# Altium project GMI.430.110 Main Board v.0.0.PrjPcb
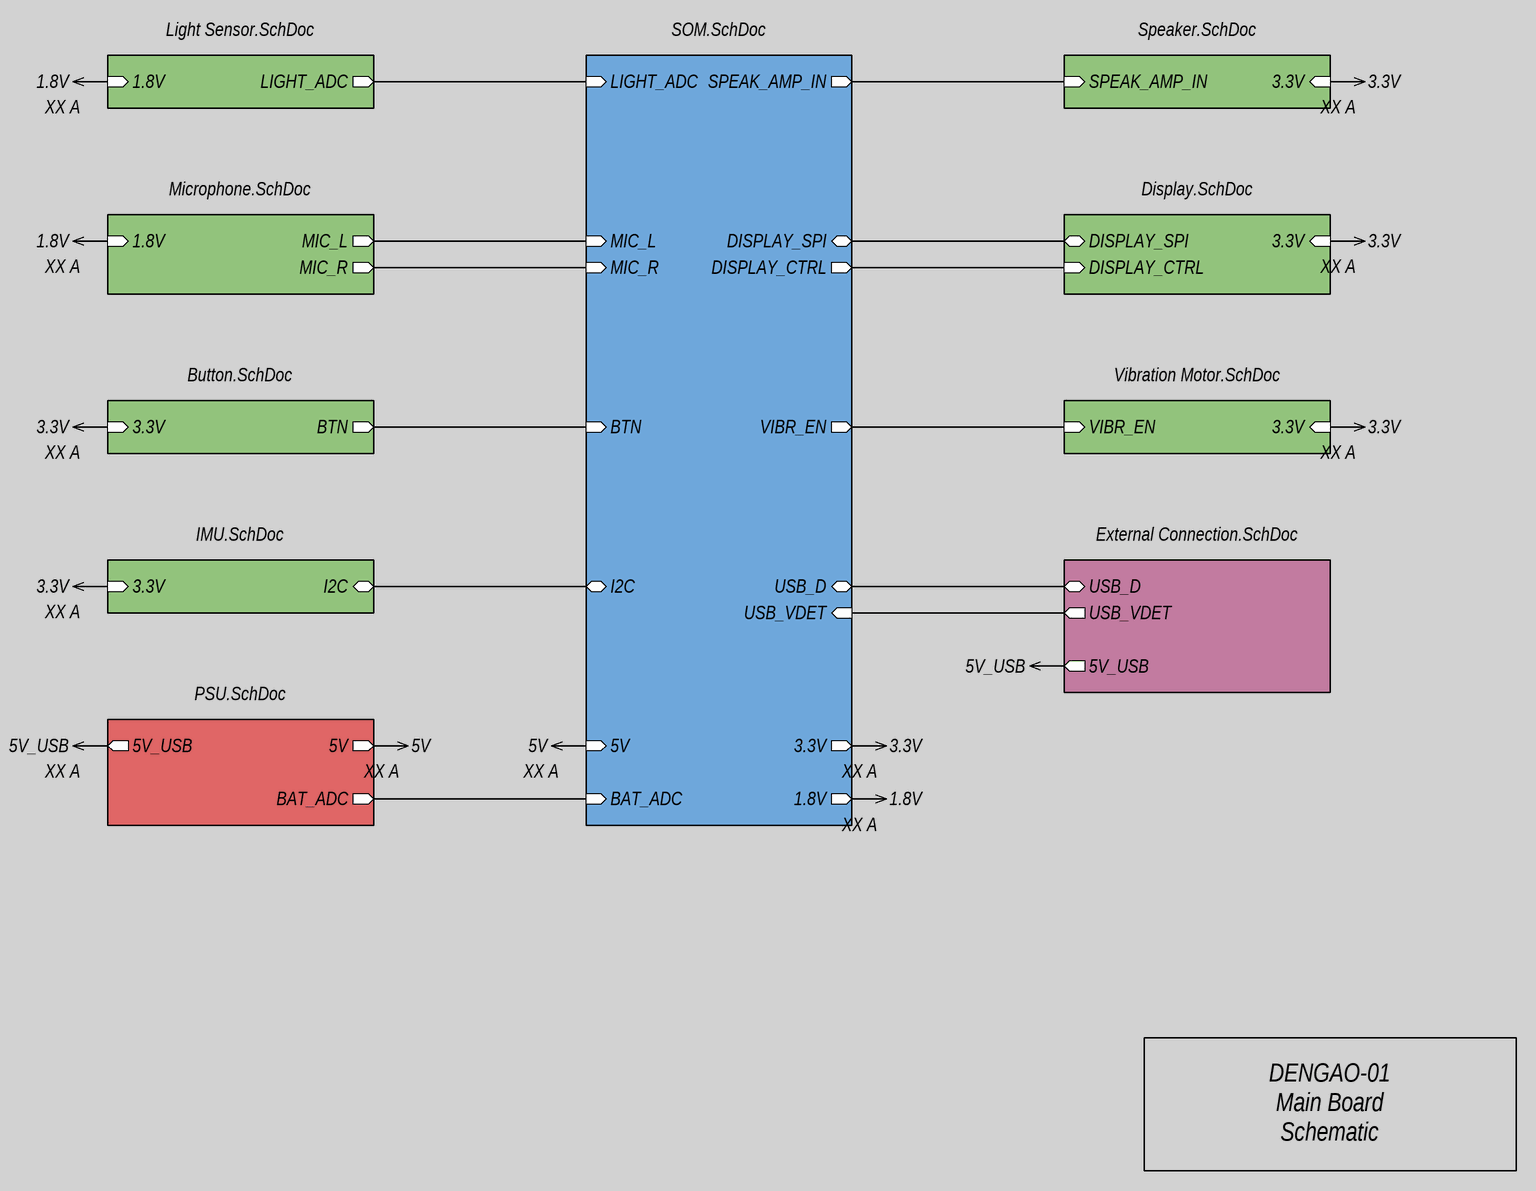
[diagram p0: Main.SchDoc]
DocumentNumberG: GMI.430.110; RevisionG: 0.0
10 sheets, 5 parts. Net scope: hierarchical (ports join the sheet entries above them; power ports are global).
Sheets:
  Main.SchDoc
    Designator = SOM.SchDoc
    Designator = IMU.SchDoc
    Designator = Microphone.SchDoc
    Designator = Display.SchDoc
    Designator = PSU.SchDoc
    Designator = Button.SchDoc
    Designator = Light Sensor.SchDoc
    Designator = External Connection.SchDoc
    Designator = Vibration Motor.SchDoc

## Sheet Main.SchDoc
size 420 x 297 mm; Author: Гавриленко; Address1: Address1; Address2: Address2; Address3: Address3; Address4: Address4; DocumentNumber: GMI.430.110; SheetNumber: 1; SheetTotal: 11; DocumentType: Схема электрическая принципиальная

### Sub-sheets
Designator = SOM.SchDoc: 5V (in), 3.3V (out), 1.8V (out), BAT_ADC (in), I2C (bidir), BTN (in), MIC_R (in), MIC_L (in), LIGHT_ADC (in), SPEAK_AMP_IN (out), DISPLAY_SPI (bidir), DISPLAY_CTRL (out), VIBR_EN (out), USB_D (bidir), USB_VDET (in)
Designator = IMU.SchDoc: I2C (bidir), 3.3V (in)
Designator = Microphone.SchDoc: MIC_L (out), 1.8V (in), MIC_R (out)
Designator = Speaker.SchDoc (file not in this document): SPEAK_AMP_IN (in), 3.3V (in)
Designator = Display.SchDoc: DISPLAY_SPI (bidir), DISPLAY_CTRL (in), 3.3V (in)
Designator = PSU.SchDoc: 5V (out), 5V_USB (out), BAT_ADC (out)
Designator = Button.SchDoc: BTN (out), 3.3V (in)
Designator = Light Sensor.SchDoc: LIGHT_ADC (out), 1.8V (in)
Designator = External Connection.SchDoc: 5V_USB (out), USB_D (bidir), USB_VDET (out)
Designator = Vibration Motor.SchDoc: VIBR_EN (in), 3.3V (in)

### Nets
1.8V: sheet Designator/1.8V, sheet Designator/1.8V, sheet Designator/1.8V
3.3V: sheet Designator/3.3V, sheet Designator/3.3V, sheet Designator/3.3V, sheet Designator/3.3V, sheet Designator/3.3V, sheet Designator/3.3V
5V: sheet Designator/5V, sheet Designator/5V
5V_USB: sheet Designator/5V_USB, sheet Designator/5V_USB
(unnamed): sheet Designator/BAT_ADC, sheet Designator/BAT_ADC
(unnamed): sheet Designator/I2C, sheet Designator/I2C
(unnamed): sheet Designator/BTN, sheet Designator/BTN
(unnamed): sheet Designator/MIC_R, sheet Designator/MIC_R
(unnamed): sheet Designator/MIC_L, sheet Designator/MIC_L
(unnamed): sheet Designator/LIGHT_ADC, sheet Designator/LIGHT_ADC
(unnamed): sheet Designator/SPEAK_AMP_IN, sheet Designator/SPEAK_AMP_IN
(unnamed): sheet Designator/DISPLAY_SPI, sheet Designator/DISPLAY_SPI
(unnamed): sheet Designator/DISPLAY_CTRL, sheet Designator/DISPLAY_CTRL
(unnamed): sheet Designator/VIBR_EN, sheet Designator/VIBR_EN
(unnamed): sheet Designator/USB_D, sheet Designator/USB_D
(unnamed): sheet Designator/USB_VDET, sheet Designator/USB_VDET

### Notes on the sheet
- XX A
- DENGAO-01
  Main Board
  Schematic
- Перв. примен.
- Справ. №
- Подп. и дата
- Инв. № дубл.
- Взам. инв. №
- Разраб.
- Изм.
- Лист
- № докум.
- Подп.
- Дата
- Лит.
- Масса
- Масштаб
- Пров.
- Т.контр.
- Листов
- Инв. № подл.
- Утв.
- Н.контр.
- Копировал
- Формат А3

## Sheet SOM.SchDoc
size 420 x 297 mm; Address1: Address1; Address2: Address2; Address3: Address3; Address4: Address4; DocumentNumber: GMI.430.110; SheetNumber: 9; SheetTotal: 10; DocumentType: Схема электрическая принципиальная
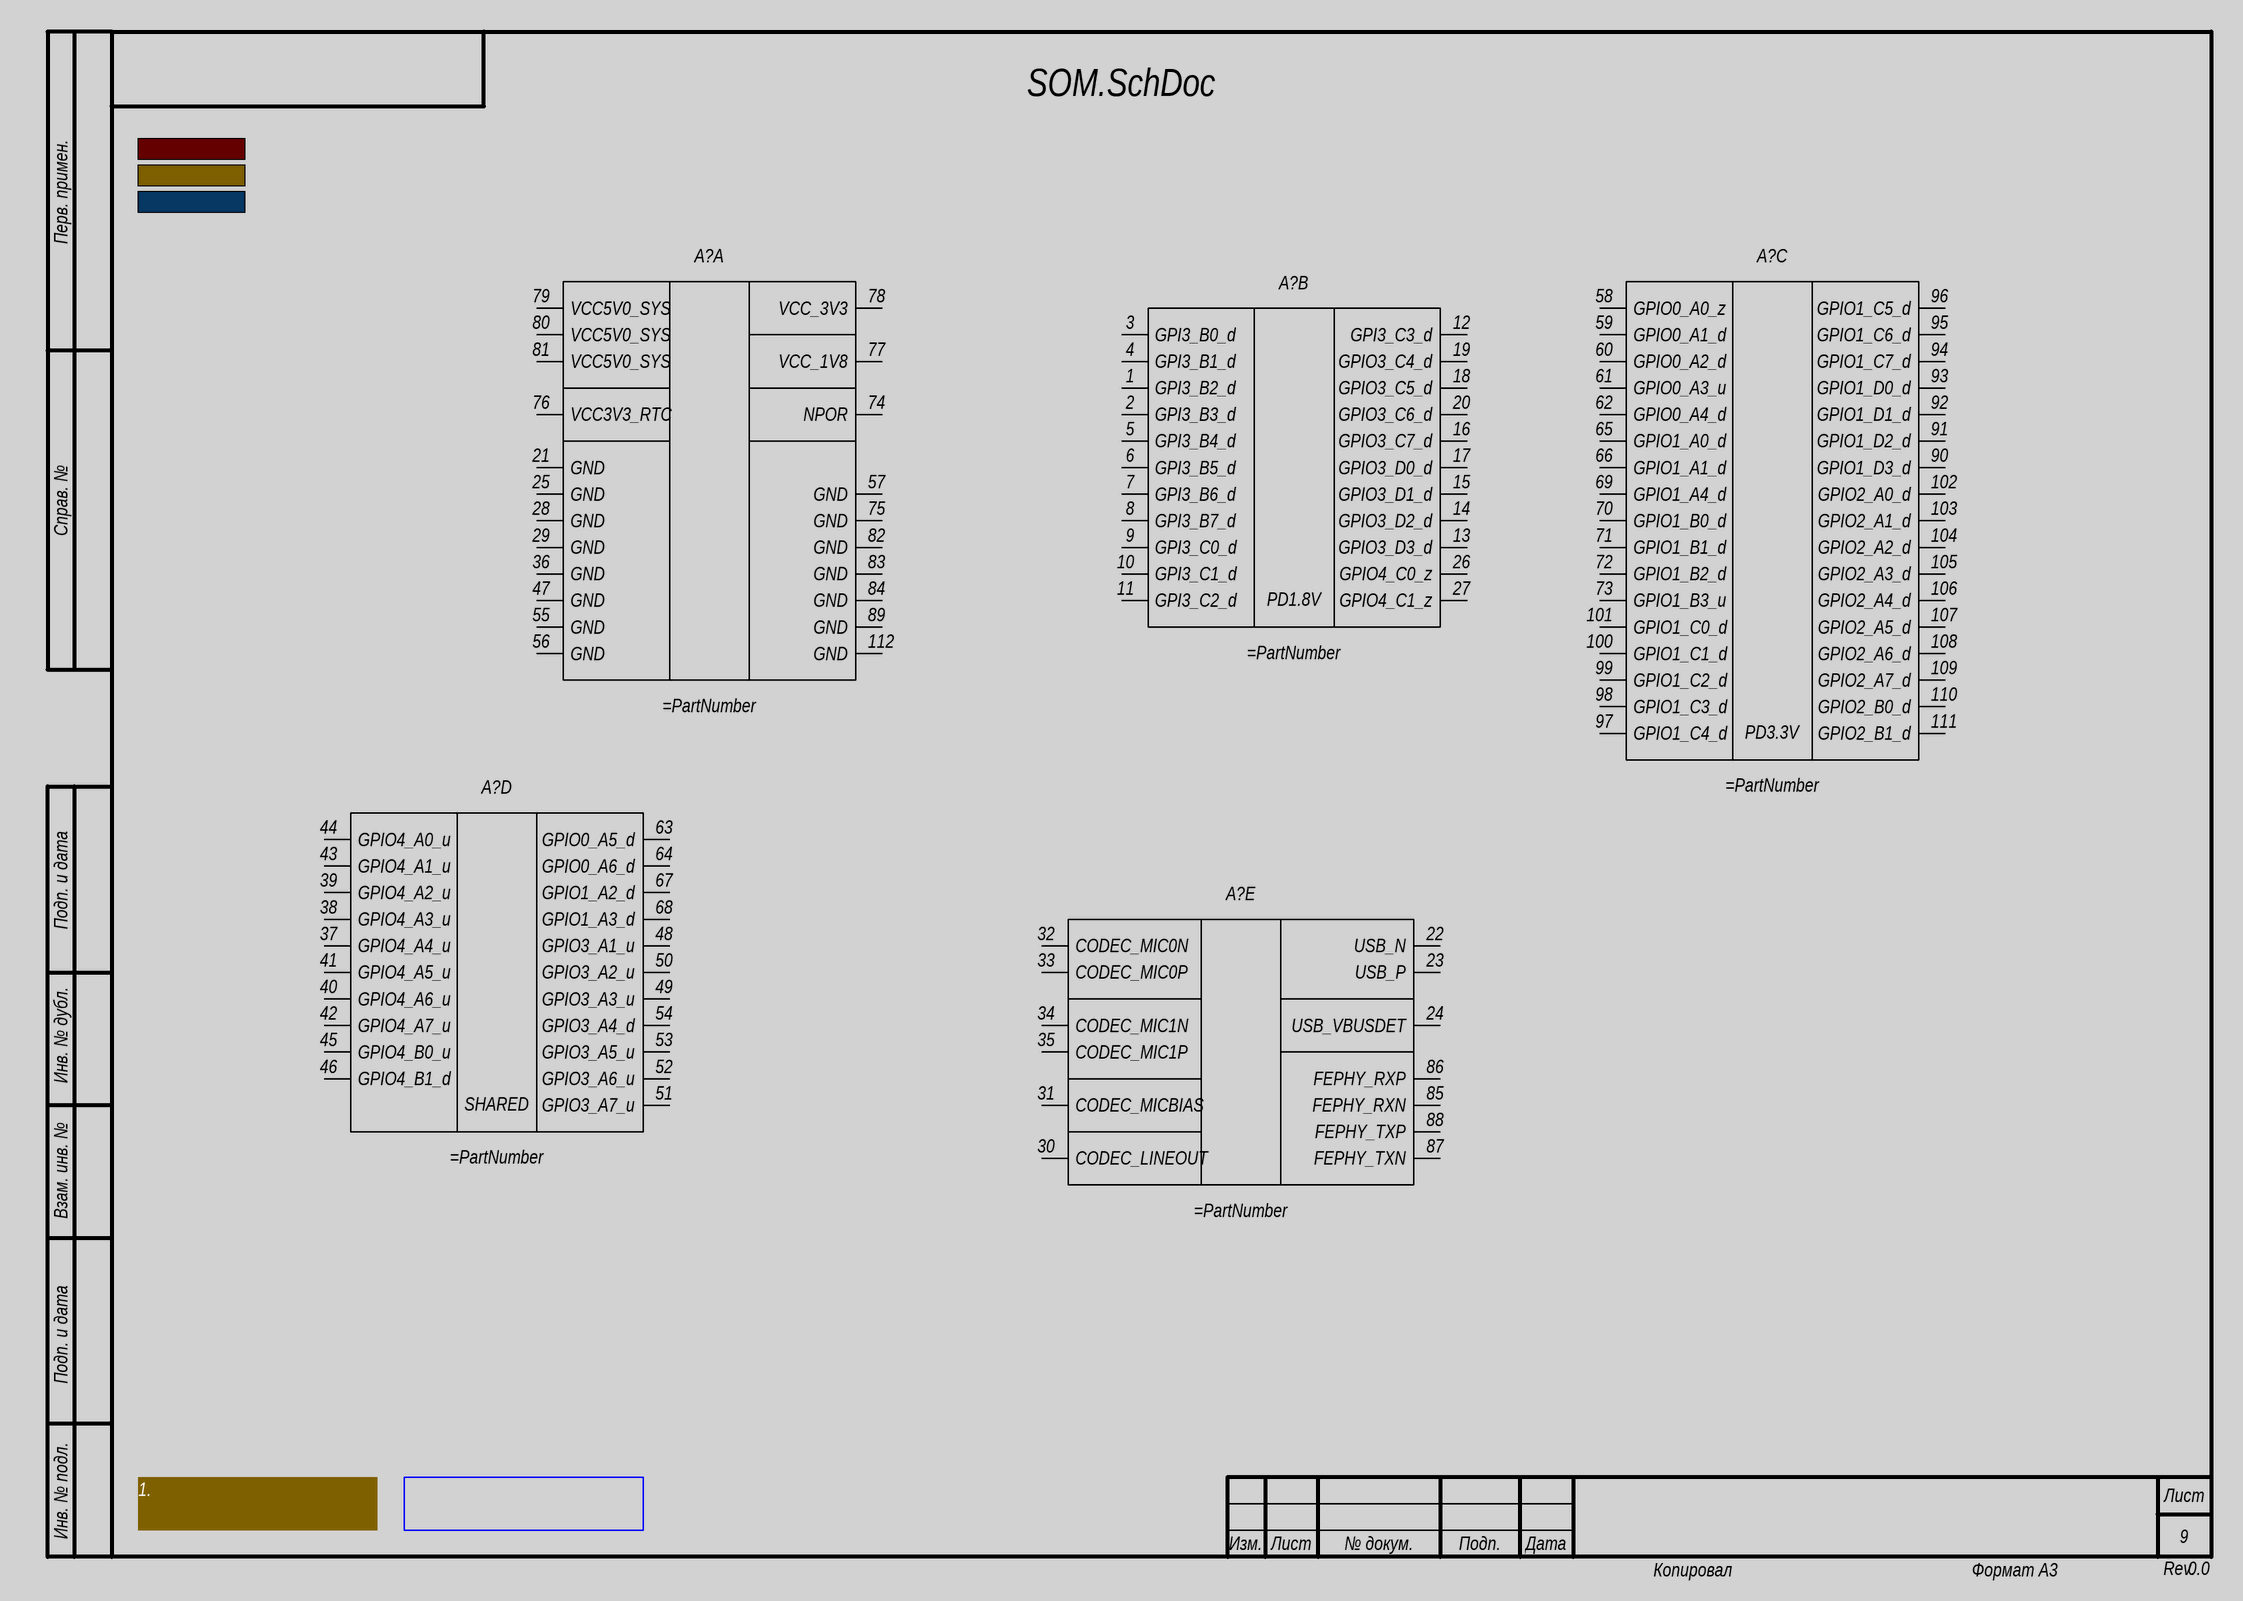
[diagram p1: SOM.SchDoc]

### Parts
(Parts that share a designator on the sheet are numbered #1, #2 ... from top to bottom, then left to right.)
A?#1  I  (value not drawn)  (part A of 5)
A?#2  I  (value not drawn)  (part C of 5)
A?#3  I  (value not drawn)  (part B of 5)
A?#4  I  (value not drawn)  (part D of 5)
A?#5  I  (value not drawn)  (part E of 5)

### Ports
 (in)

### Nets

Not connected (* = marked no-connect by the designer): A?#1 21(GND) 25(GND) 28(GND) 29(GND) 36(GND) 47(GND) 55(GND) 56(GND) 57(GND) 74(NPOR) 75(GND) 76(VCC3V3_RTC) 77(VCC_1V8) 78(VCC_3V3) 79(VCC5V0_SYS) 80(VCC5V0_SYS) 81(VCC5V0_SYS) 82(GND) 83(GND) 84(GND) 89(GND) 112(GND); A?#2 58(GPIO0_A0_z) 59(GPIO0_A1_d) 60(GPIO0_A2_d) 61(GPIO0_A3_u) 62(GPIO0_A4_d) 65(GPIO1_A0_d) 66(GPIO1_A1_d) 69(GPIO1_A4_d) 70(GPIO1_B0_d) 71(GPIO1_B1_d) 72(GPIO1_B2_d) 73(GPIO1_B3_u) 90(GPIO1_D3_d) 91(GPIO1_D2_d) 92(GPIO1_D1_d) 93(GPIO1_D0_d) 94(GPIO1_C7_d) 95(GPIO1_C6_d) 96(GPIO1_C5_d) 97(GPIO1_C4_d) 98(GPIO1_C3_d) 99(GPIO1_C2_d) 100(GPIO1_C1_d) 101(GPIO1_C0_d) 102(GPIO2_A0_d) 103(GPIO2_A1_d) 104(GPIO2_A2_d) 105(GPIO2_A3_d) 106(GPIO2_A4_d) 107(GPIO2_A5_d) 108(GPIO2_A6_d) 109(GPIO2_A7_d) 110(GPIO2_B0_d) 111(GPIO2_B1_d); A?#3 1(GPI3_B2_d) 2(GPI3_B3_d) 3(GPI3_B0_d) 4(GPI3_B1_d) 5(GPI3_B4_d) 6(GPI3_B5_d) 7(GPI3_B6_d) 8(GPI3_B7_d) 9(GPI3_C0_d) 10(GPI3_C1_d) 11(GPI3_C2_d) 12(GPI3_C3_d) 13(GPIO3_D3_d) 14(GPIO3_D2_d) 15(GPIO3_D1_d) 16(GPIO3_C7_d) 17(GPIO3_D0_d) 18(GPIO3_C5_d) 19(GPIO3_C4_d) 20(GPIO3_C6_d) 26(GPIO4_C0_z) 27(GPIO4_C1_z); A?#4 37(GPIO4_A4_u) 38(GPIO4_A3_u) 39(GPIO4_A2_u) 40(GPIO4_A6_u) 41(GPIO4_A5_u) 42(GPIO4_A7_u) 43(GPIO4_A1_u) 44(GPIO4_A0_u) 45(GPIO4_B0_u) 46(GPIO4_B1_d) 48(GPIO3_A1_u) 49(GPIO3_A3_u) 50(GPIO3_A2_u) 51(GPIO3_A7_u) 52(GPIO3_A6_u) 53(GPIO3_A5_u) 54(GPIO3_A4_d) 63(GPIO0_A5_d) 64(GPIO0_A6_d) 67(GPIO1_A2_d) 68(GPIO1_A3_d); A?#5 22(USB_N) 23(USB_P) 24(USB_VBUSDET) 30(CODEC_LINEOUT) 31(CODEC_MICBIAS) 32(CODEC_MIC0N) 33(CODEC_MIC0P) 34(CODEC_MIC1N) 35(CODEC_MIC1P) 85(FEPHY_RXN) 86(FEPHY_RXP) 87(FEPHY_TXN) 88(FEPHY_TXP)

### Notes on the sheet
- 1.
- Rev.
- Перв. примен.
- Справ. №
- Подп. и дата
- Инв. № дубл.
- Взам. инв. №
- Инв. № подл.
- Изм.
- Лист
- № докум.
- Подп.
- Дата
- Копировал
- Формат А3
- (in symbol Core1106, part B) PD1.8V
- (in symbol Core1106, part C) PD3.3V
- (in symbol Core1106, part D) SHARED

### Library data of the parts
A?#1-A?#5 = Core1106: RV1106 Development Board; Manufacturer: Shenzhen Luckfox Tecnology Co., Ltd.; TemperatureRange: -10...+80°C; ClassName: General; ComponentType: Модуль; Install: I

## Sheet IMU.SchDoc
size 420 x 297 mm; Address1: Address1; Address2: Address2; Address3: Address3; Address4: Address4; DocumentNumber: GMI.430.110; SheetNumber: 7; SheetTotal: 10; DocumentType: Схема электрическая принципиальная
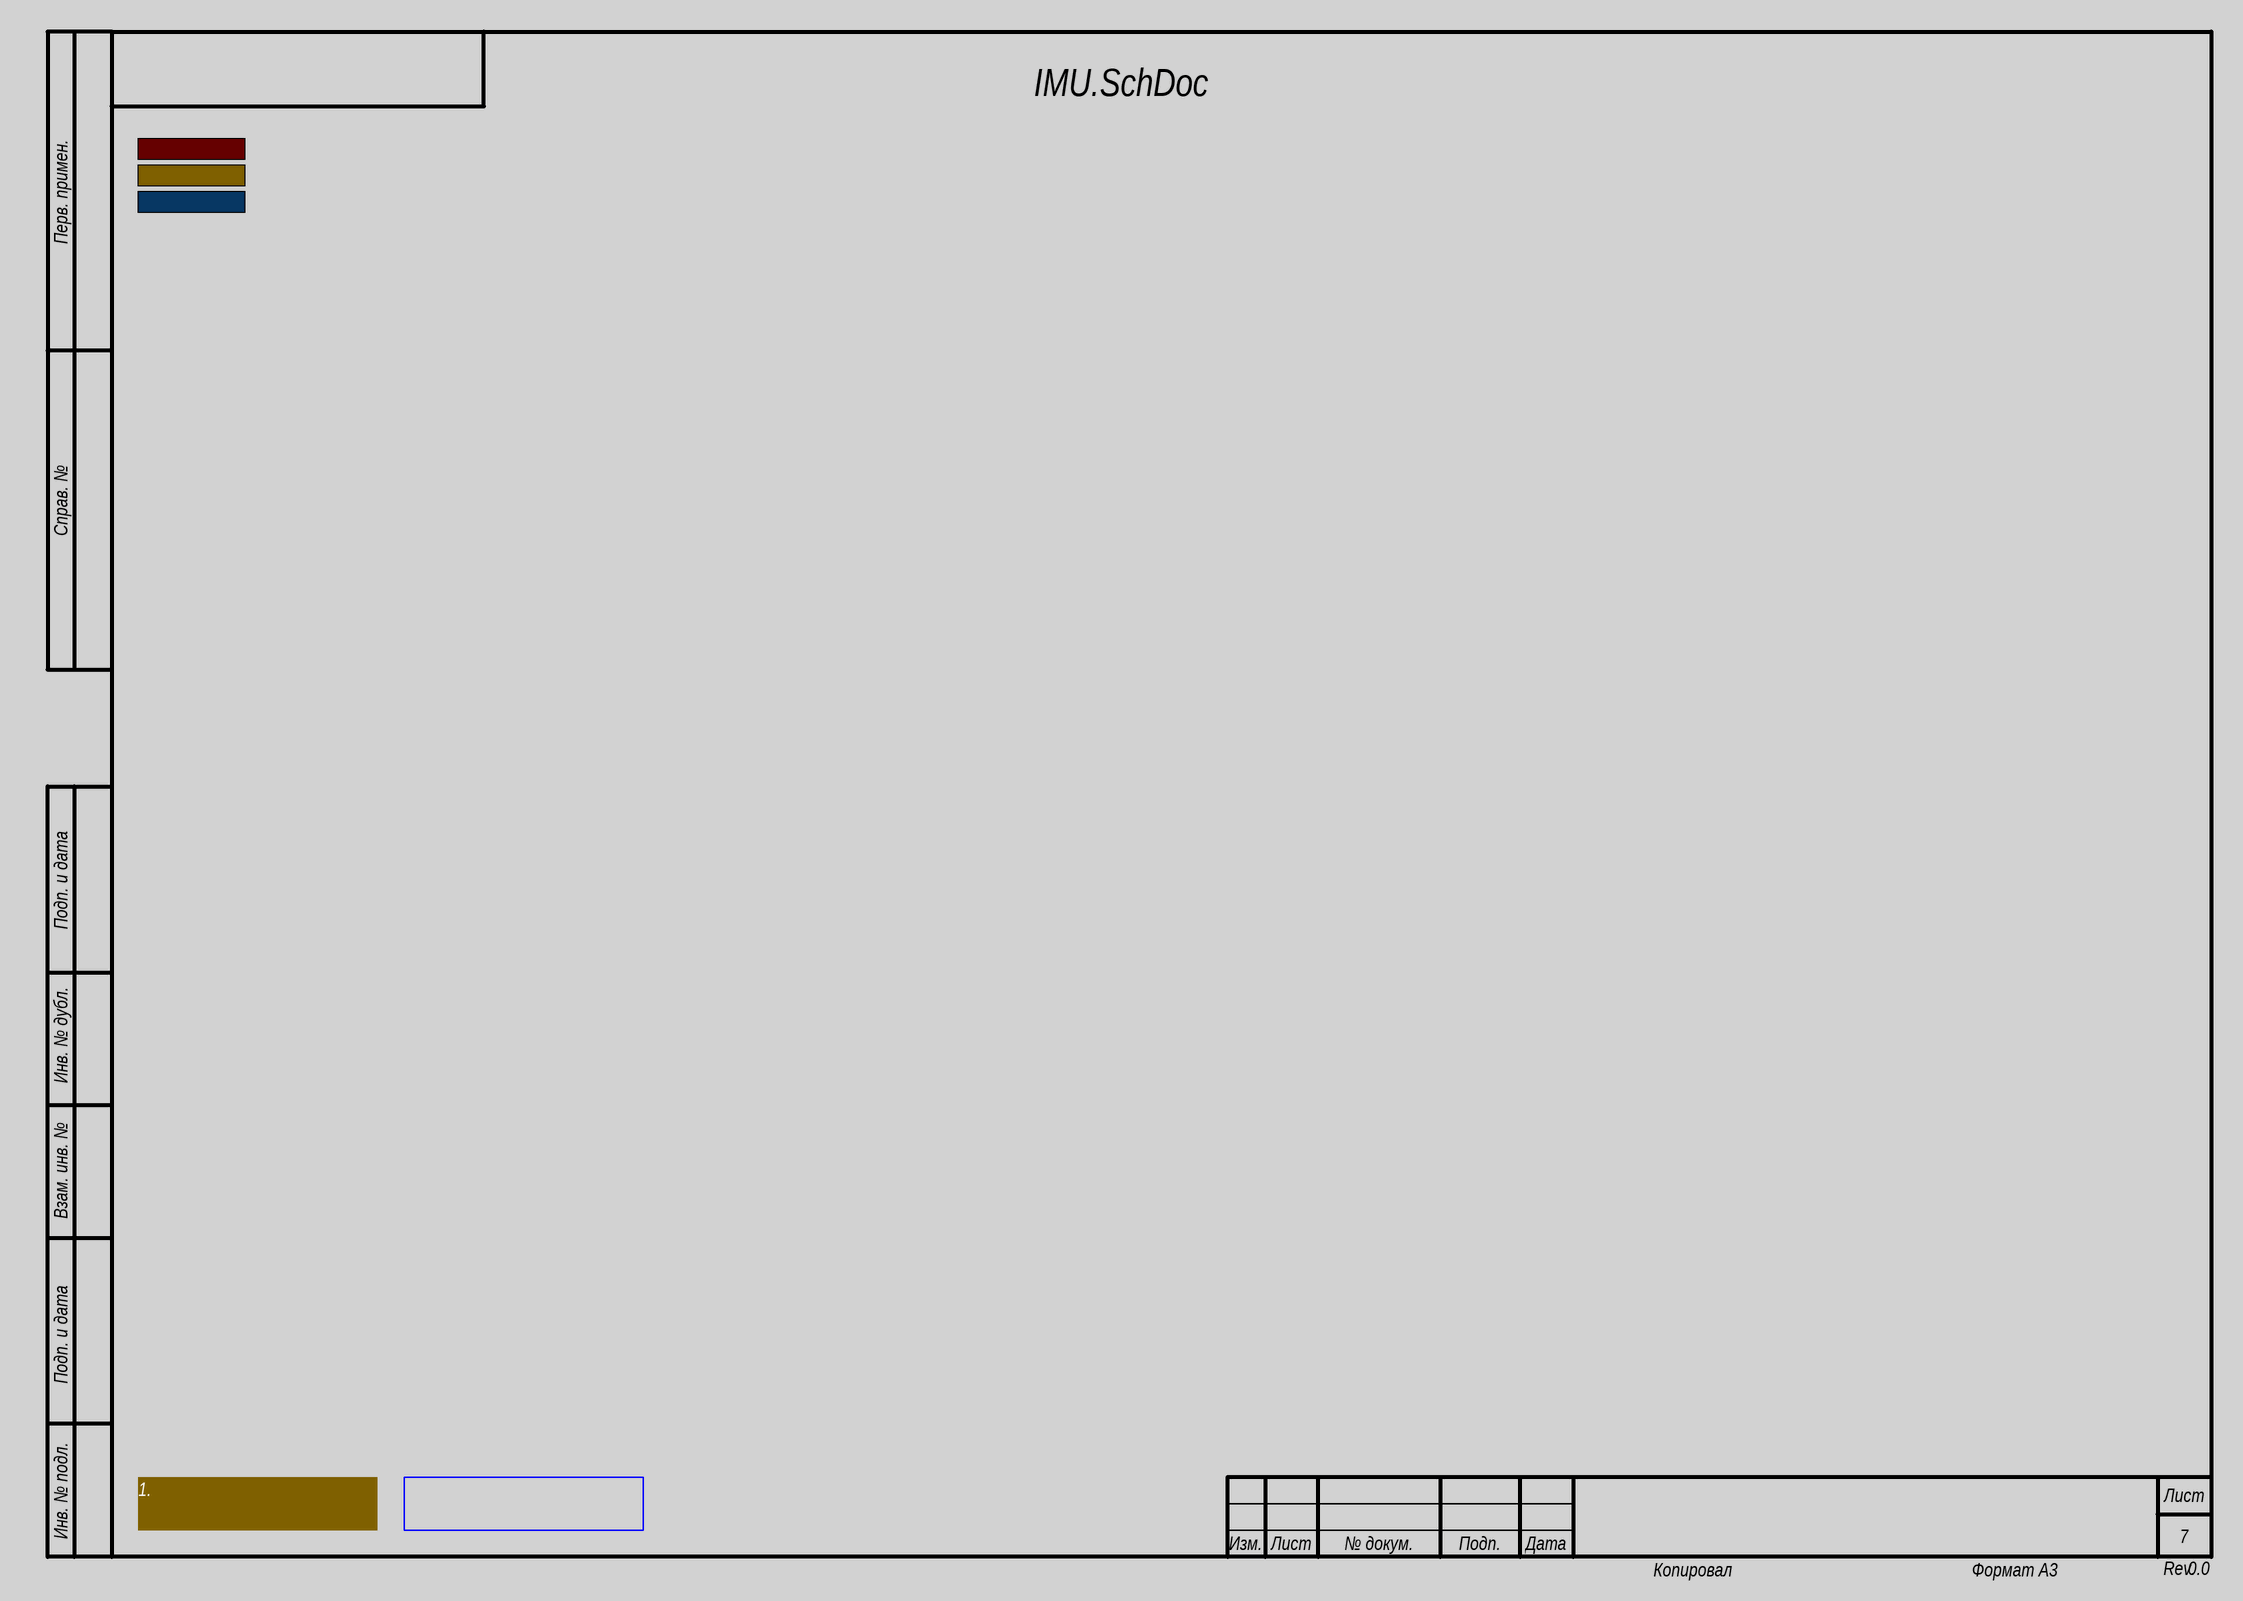
[diagram p2: IMU.SchDoc]

### Ports
 (in)

### Notes on the sheet
- 1.
- Rev.
- Перв. примен.
- Справ. №
- Подп. и дата
- Инв. № дубл.
- Взам. инв. №
- Инв. № подл.
- Изм.
- Лист
- № докум.
- Подп.
- Дата
- Копировал
- Формат А3

## Sheet Microphone.SchDoc
size 420 x 297 mm; Address1: Address1; Address2: Address2; Address3: Address3; Address4: Address4; DocumentNumber: GMI.430.110; SheetNumber: 8; SheetTotal: 10; DocumentType: Схема электрическая принципиальная
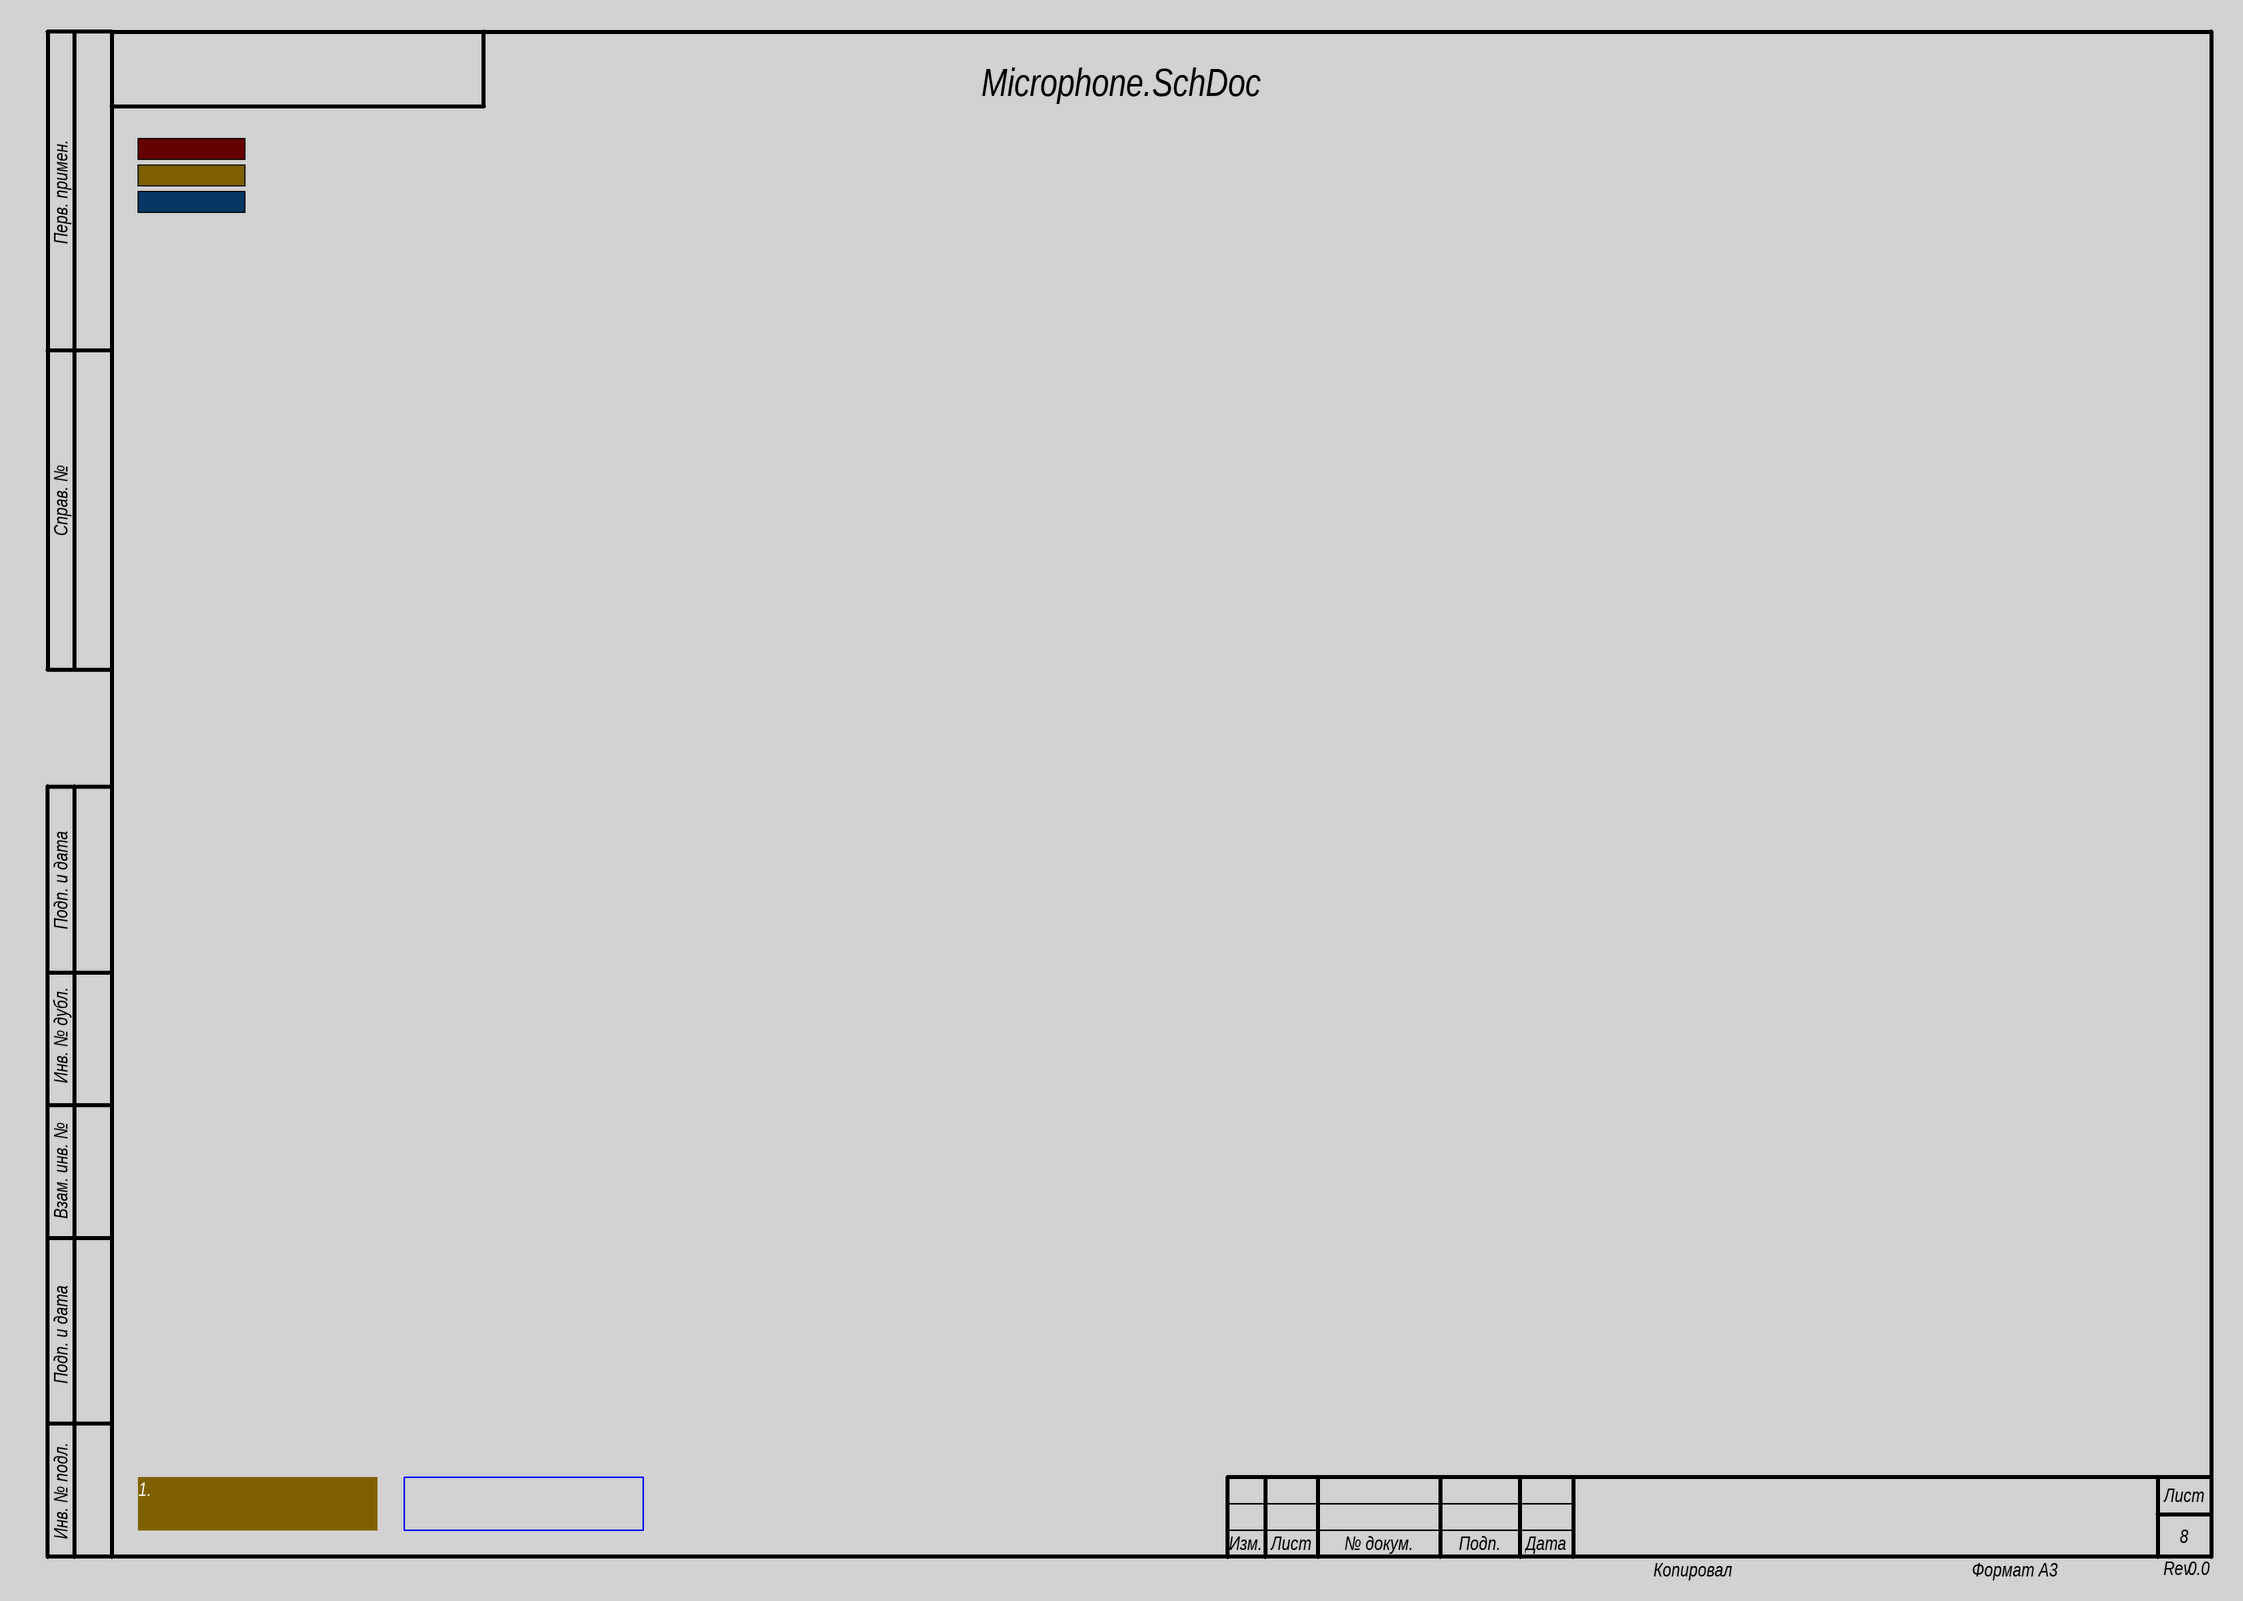
[diagram p3: Microphone.SchDoc]

### Ports
 (in)

### Notes on the sheet
- 1.
- Rev.
- Перв. примен.
- Справ. №
- Подп. и дата
- Инв. № дубл.
- Взам. инв. №
- Инв. № подл.
- Изм.
- Лист
- № докум.
- Подп.
- Дата
- Копировал
- Формат А3

## Sheet Display.SchDoc
size 420 x 297 mm; Address1: Address1; Address2: Address2; Address3: Address3; Address4: Address4; DocumentNumber: GMI.430.110; SheetNumber: 5; SheetTotal: 10; DocumentType: Схема электрическая принципиальная
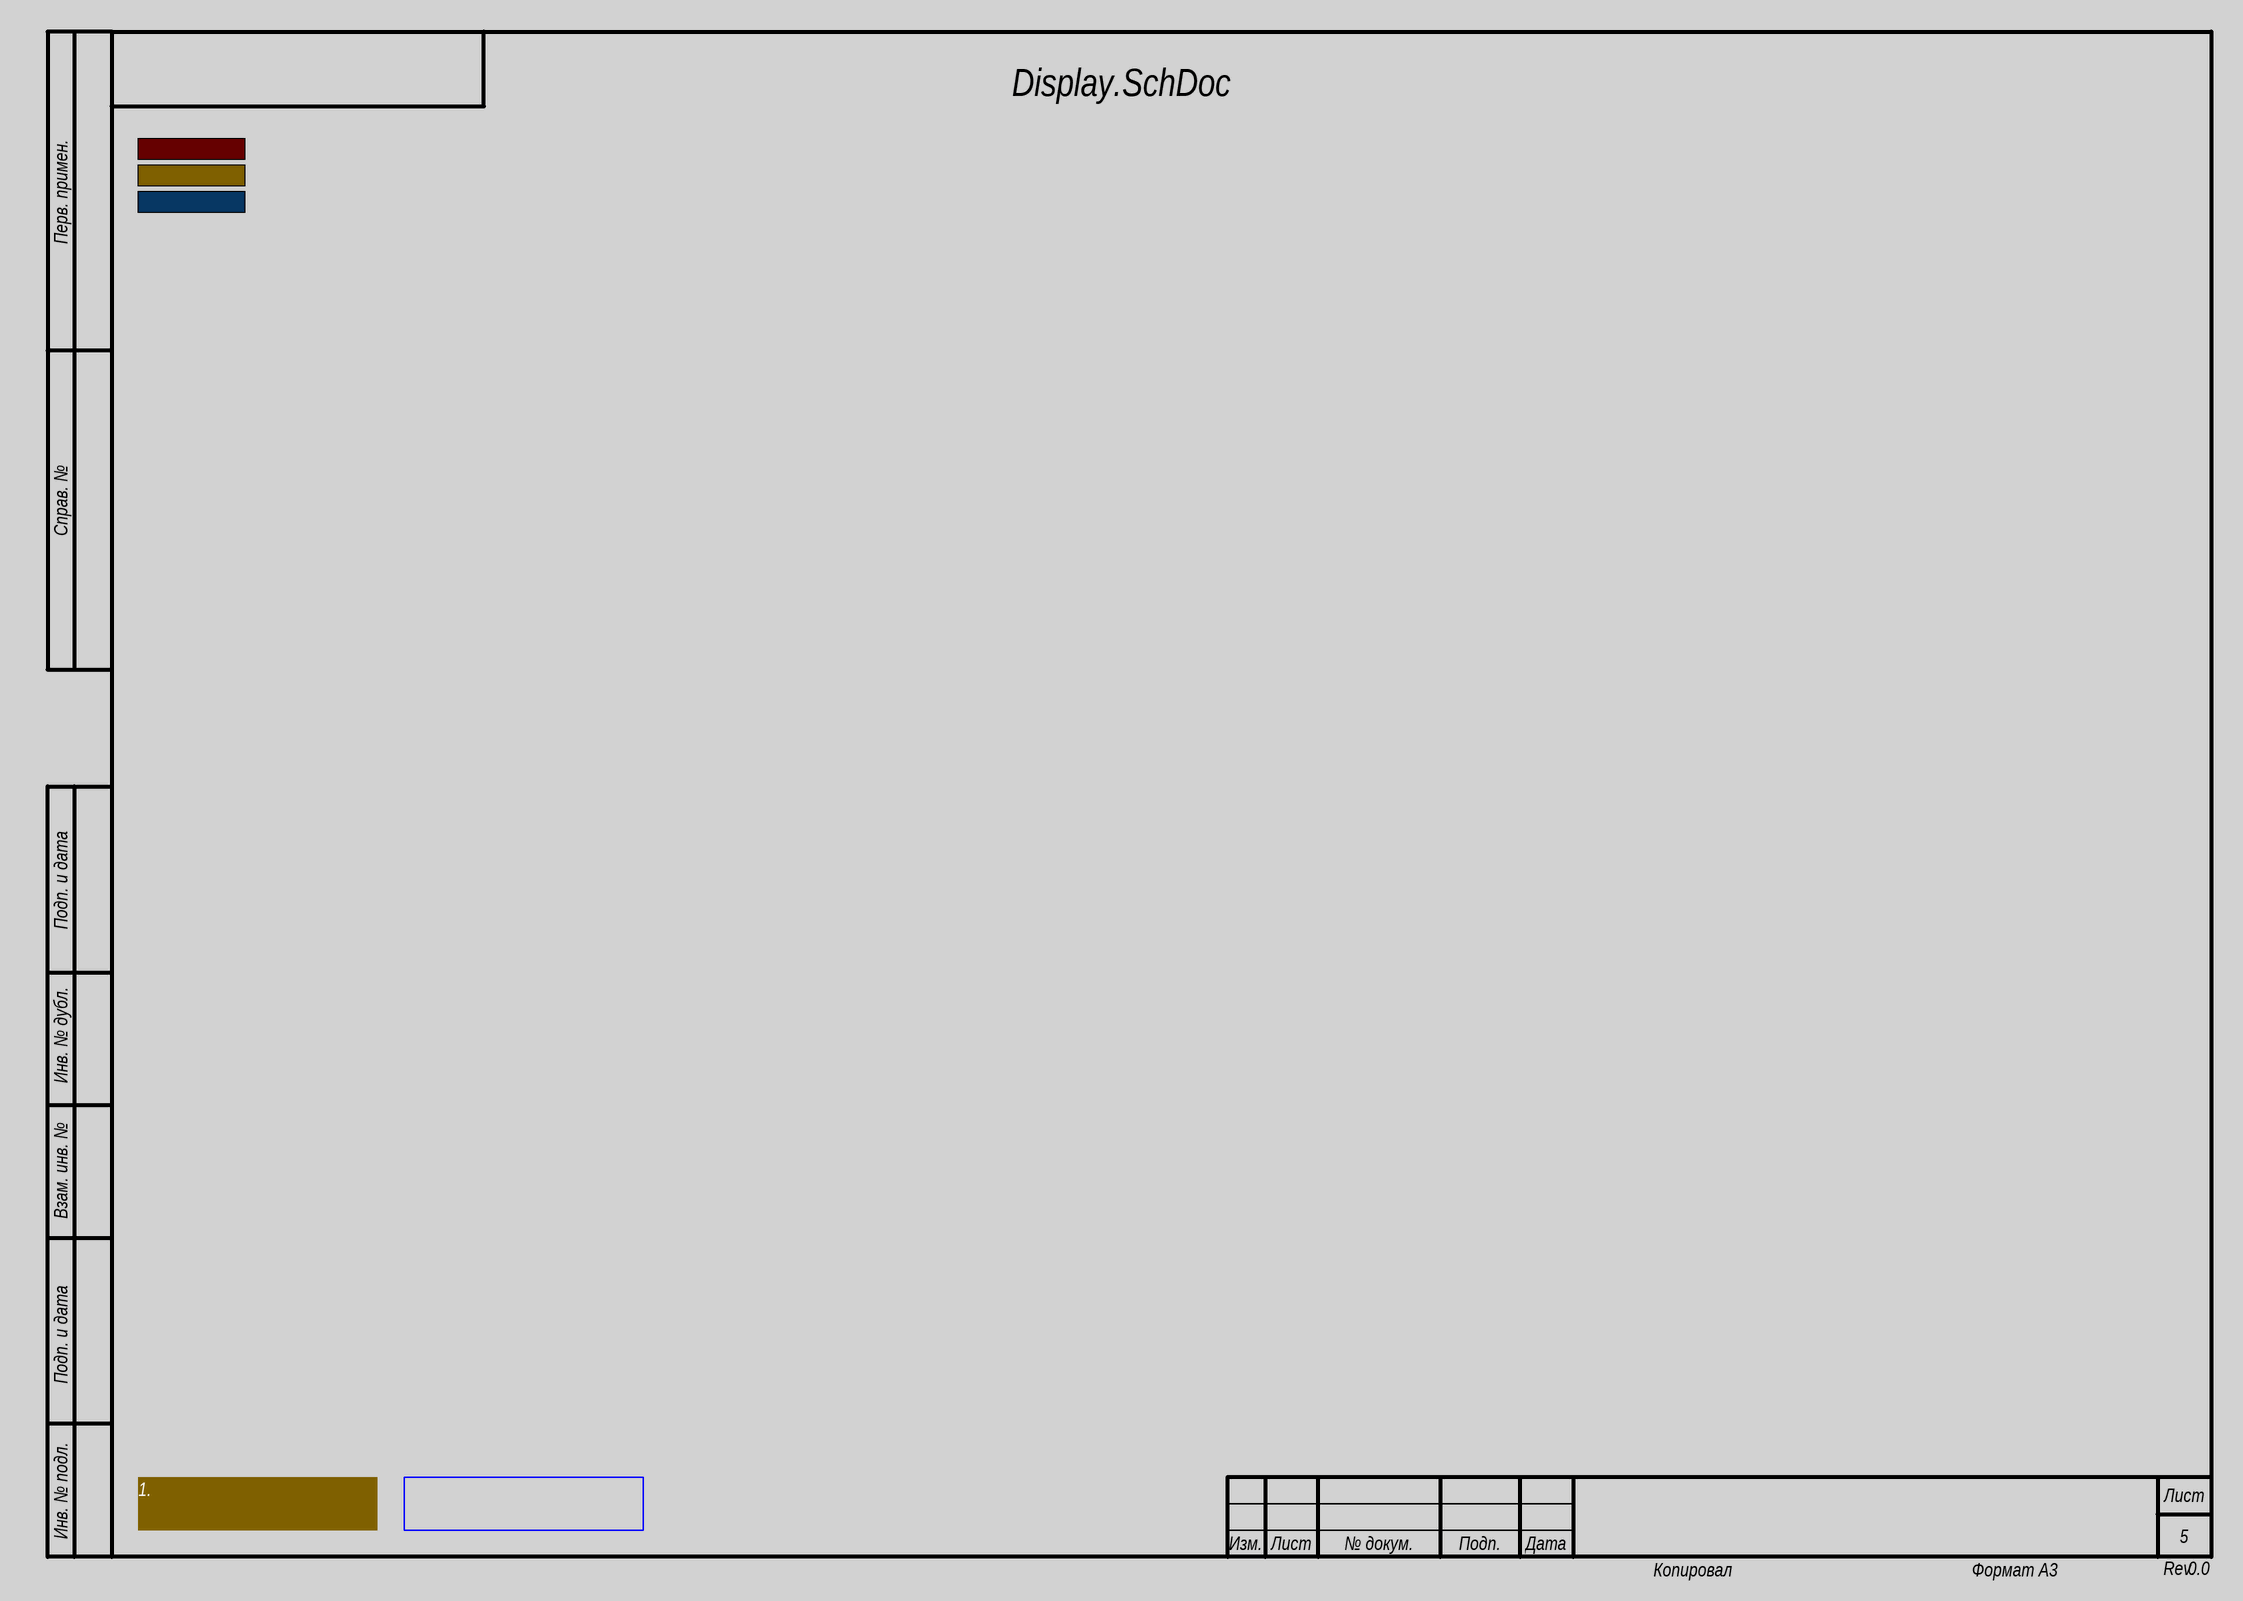
[diagram p4: Display.SchDoc]

### Ports
 (in)

### Notes on the sheet
- 1.
- Rev.
- Перв. примен.
- Справ. №
- Подп. и дата
- Инв. № дубл.
- Взам. инв. №
- Инв. № подл.
- Изм.
- Лист
- № докум.
- Подп.
- Дата
- Копировал
- Формат А3

## Sheet PSU.SchDoc
size 420 x 297 mm; Address1: Address1; Address2: Address2; Address3: Address3; Address4: Address4; DocumentNumber: GMI.430.110; SheetNumber: 2; SheetTotal: 2; DocumentType: Схема электрическая принципиальная
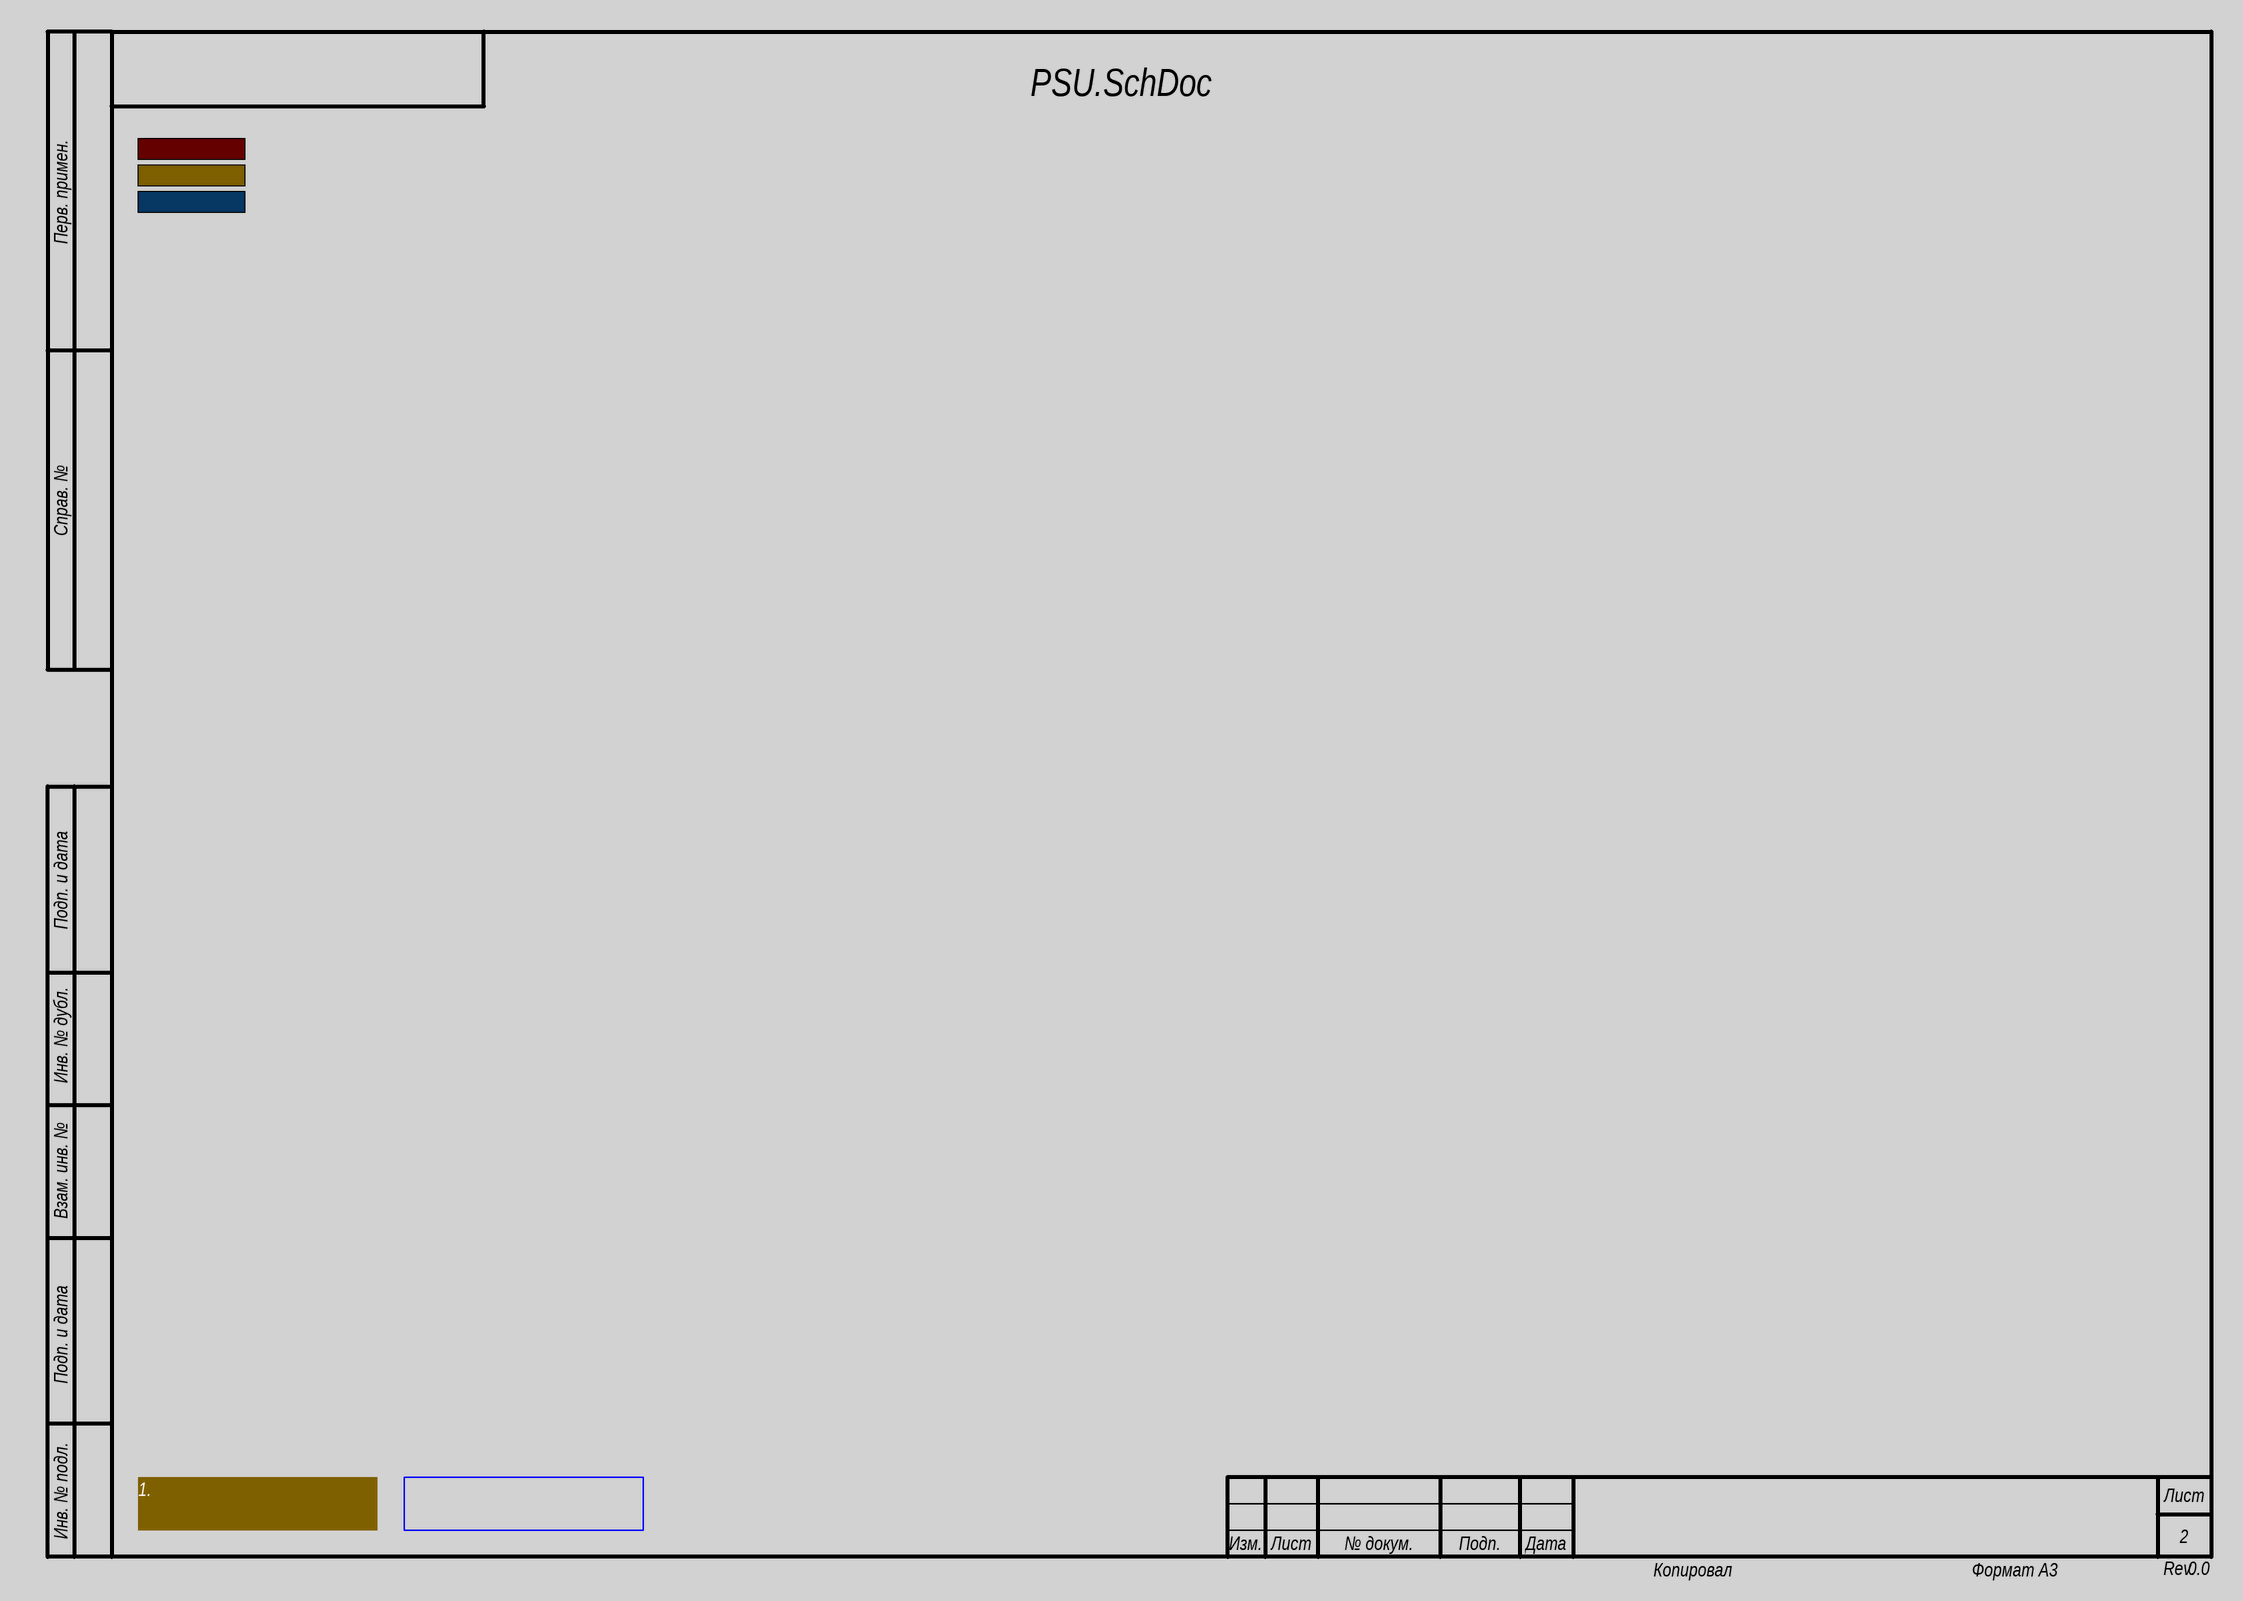
[diagram p5: PSU.SchDoc]

### Ports
 (in, see Main[1B], Current Sensing Main[1C], PSU Backup[1B], PSU Main[1B], Switch Backup[1A]),  (in, see Main[2B], Current Sensing Main[4A]),  (in, see Main[2B], Current Sensing Main[4A], PSU Backup[4B], PSU Control[4A], PSU Main[4B], Switch Backup[1A], Switch Main[1A])

### Notes on the sheet
- 1.
- Rev.
- Перв. примен.
- Справ. №
- Подп. и дата
- Инв. № дубл.
- Взам. инв. №
- Инв. № подл.
- Изм.
- Лист
- № докум.
- Подп.
- Дата
- Копировал
- Формат А3

## Sheet Button.SchDoc
size 420 x 297 mm; Address1: Address1; Address2: Address2; Address3: Address3; Address4: Address4; DocumentNumber: GMI.430.110; SheetNumber: 1; SheetTotal: 11; DocumentType: Схема электрическая принципиальная
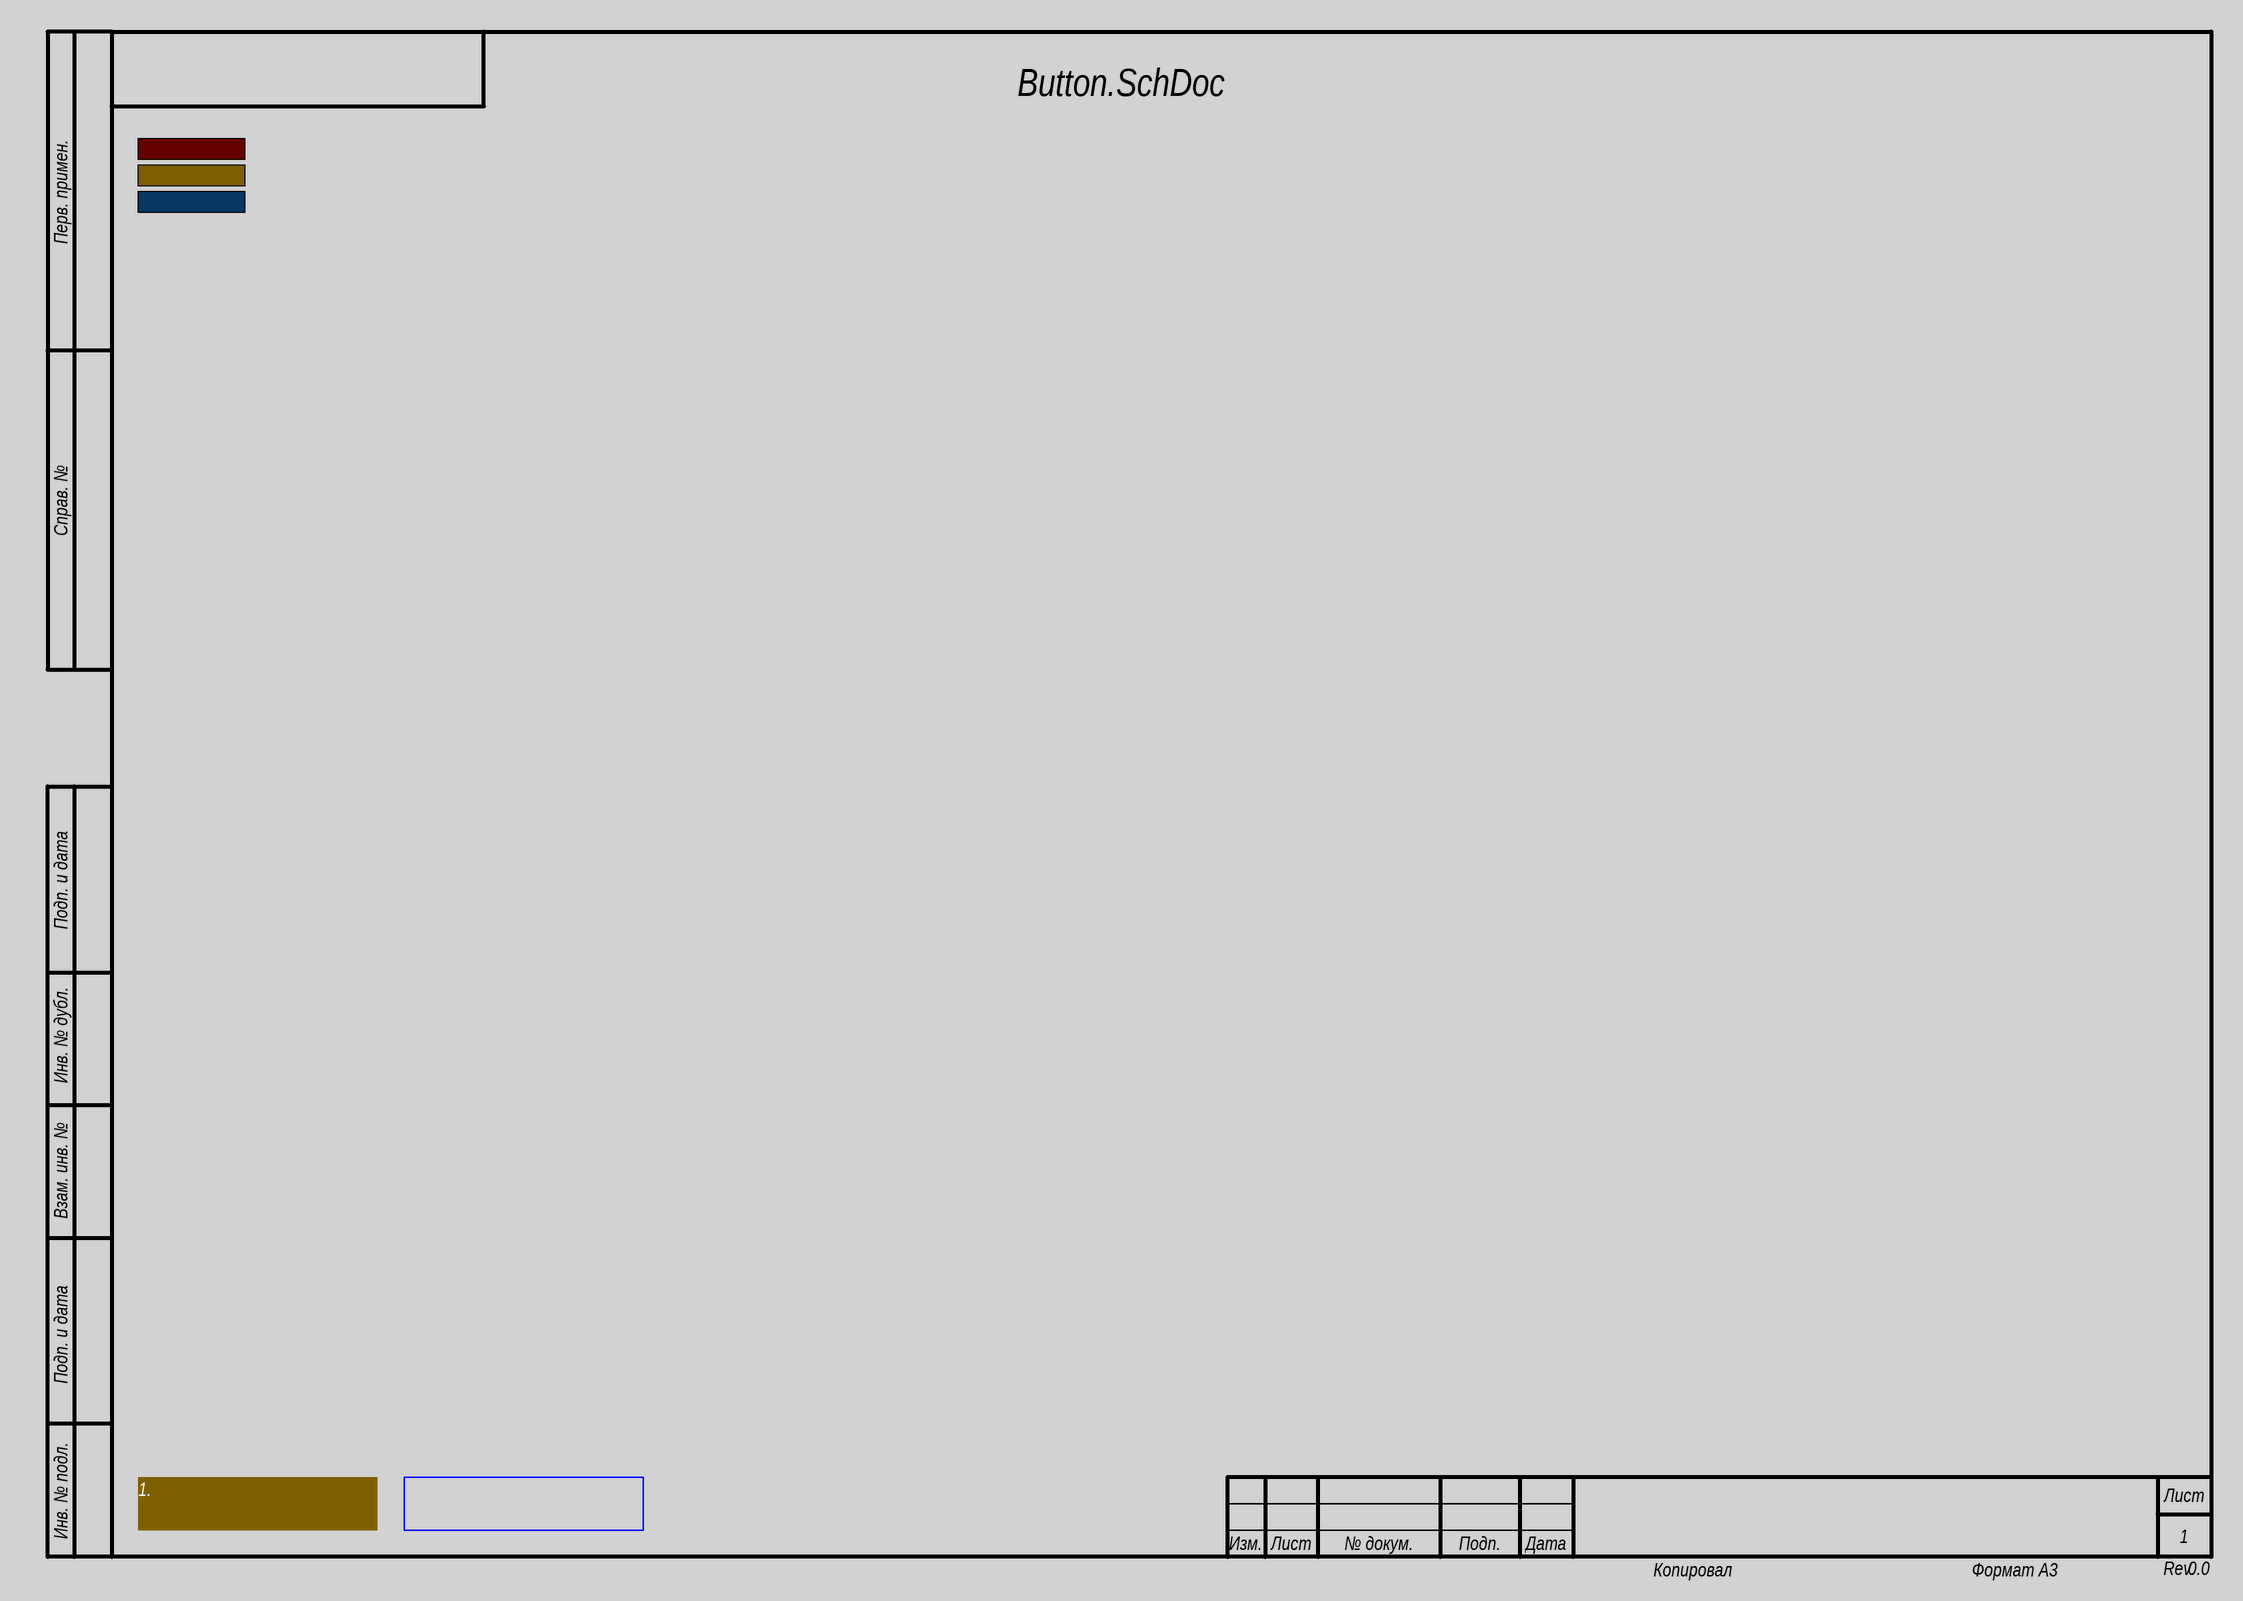
[diagram p6: Button.SchDoc]

### Ports
 (in)

### Notes on the sheet
- 1.
- Rev.
- Перв. примен.
- Справ. №
- Подп. и дата
- Инв. № дубл.
- Взам. инв. №
- Инв. № подл.
- Изм.
- Лист
- № докум.
- Подп.
- Дата
- Копировал
- Формат А3

## Sheet Light Sensor.SchDoc
size 420 x 297 mm; Address1: Address1; Address2: Address2; Address3: Address3; Address4: Address4; DocumentNumber: GMI.430.110; SheetNumber: 6; SheetTotal: 10; DocumentType: Схема электрическая принципиальная
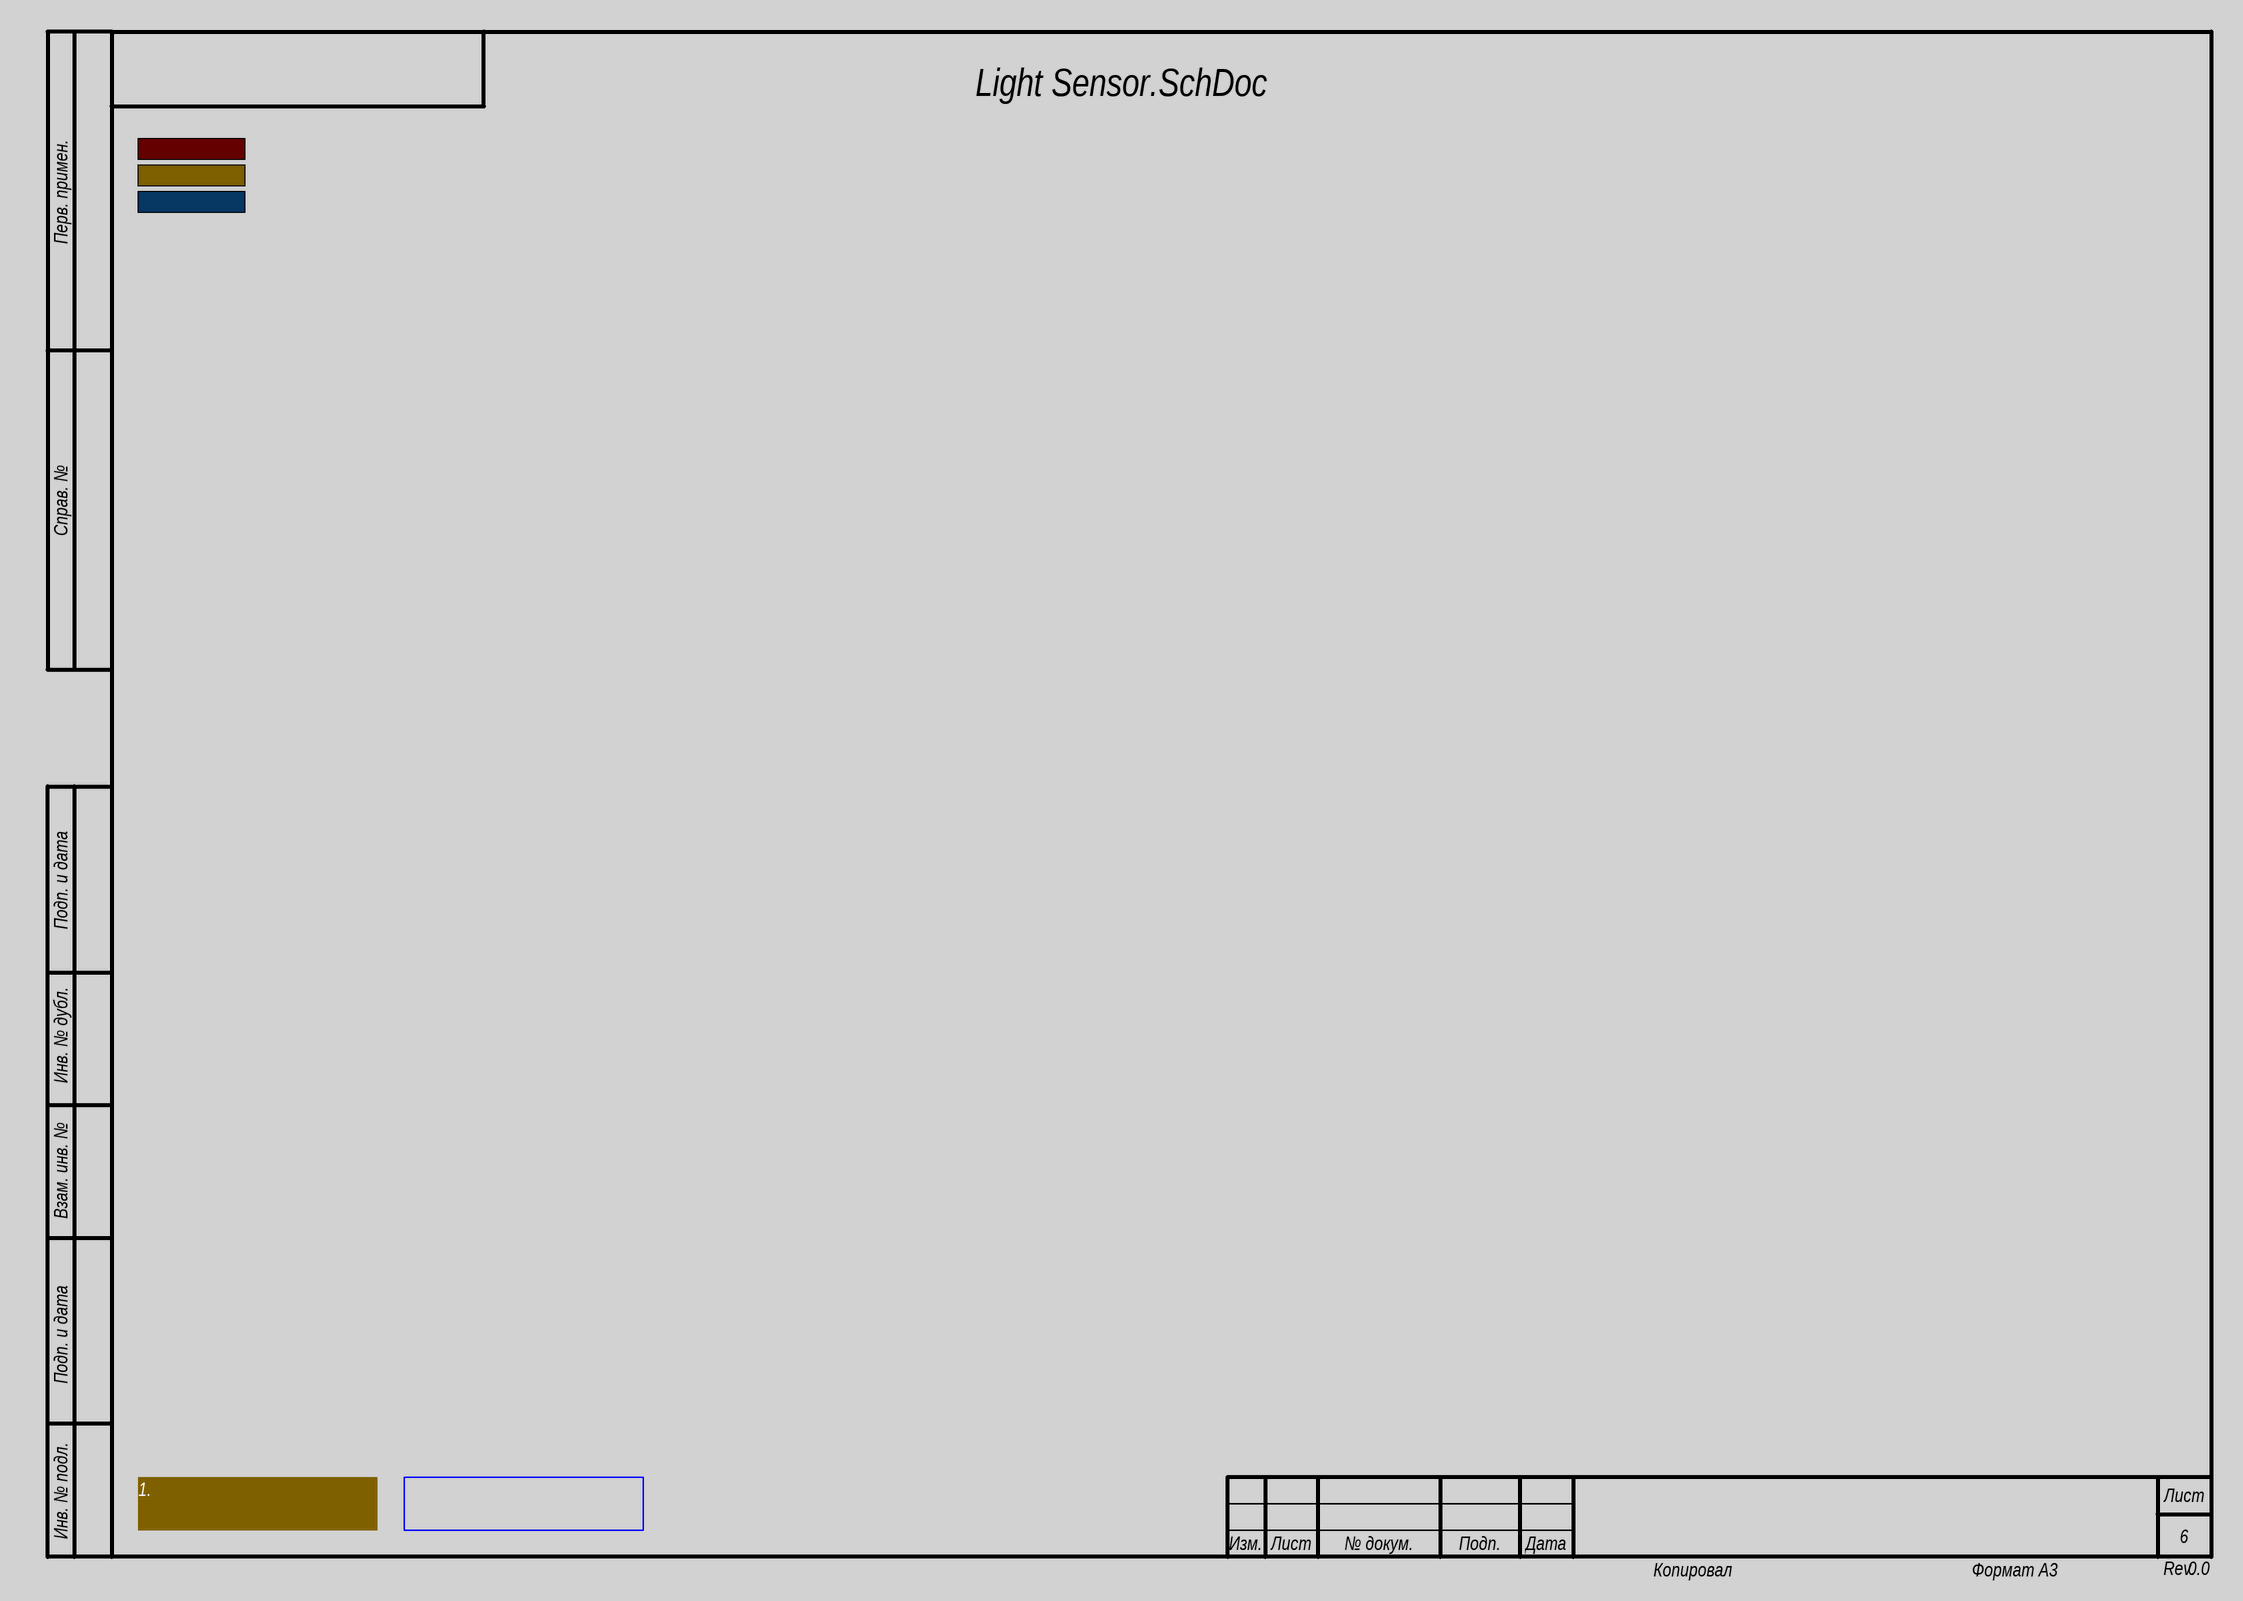
[diagram p7: Light Sensor.SchDoc]

### Ports
 (in)

### Notes on the sheet
- 1.
- Rev.
- Перв. примен.
- Справ. №
- Подп. и дата
- Инв. № дубл.
- Взам. инв. №
- Инв. № подл.
- Изм.
- Лист
- № докум.
- Подп.
- Дата
- Копировал
- Формат А3

## Sheet External Connection.SchDoc
size 420 x 297 mm; Address1: Address1; Address2: Address2; Address3: Address3; Address4: Address4; DocumentNumber: GMI.430.110; SheetNumber: 4; SheetTotal: 10; DocumentType: Схема электрическая принципиальная
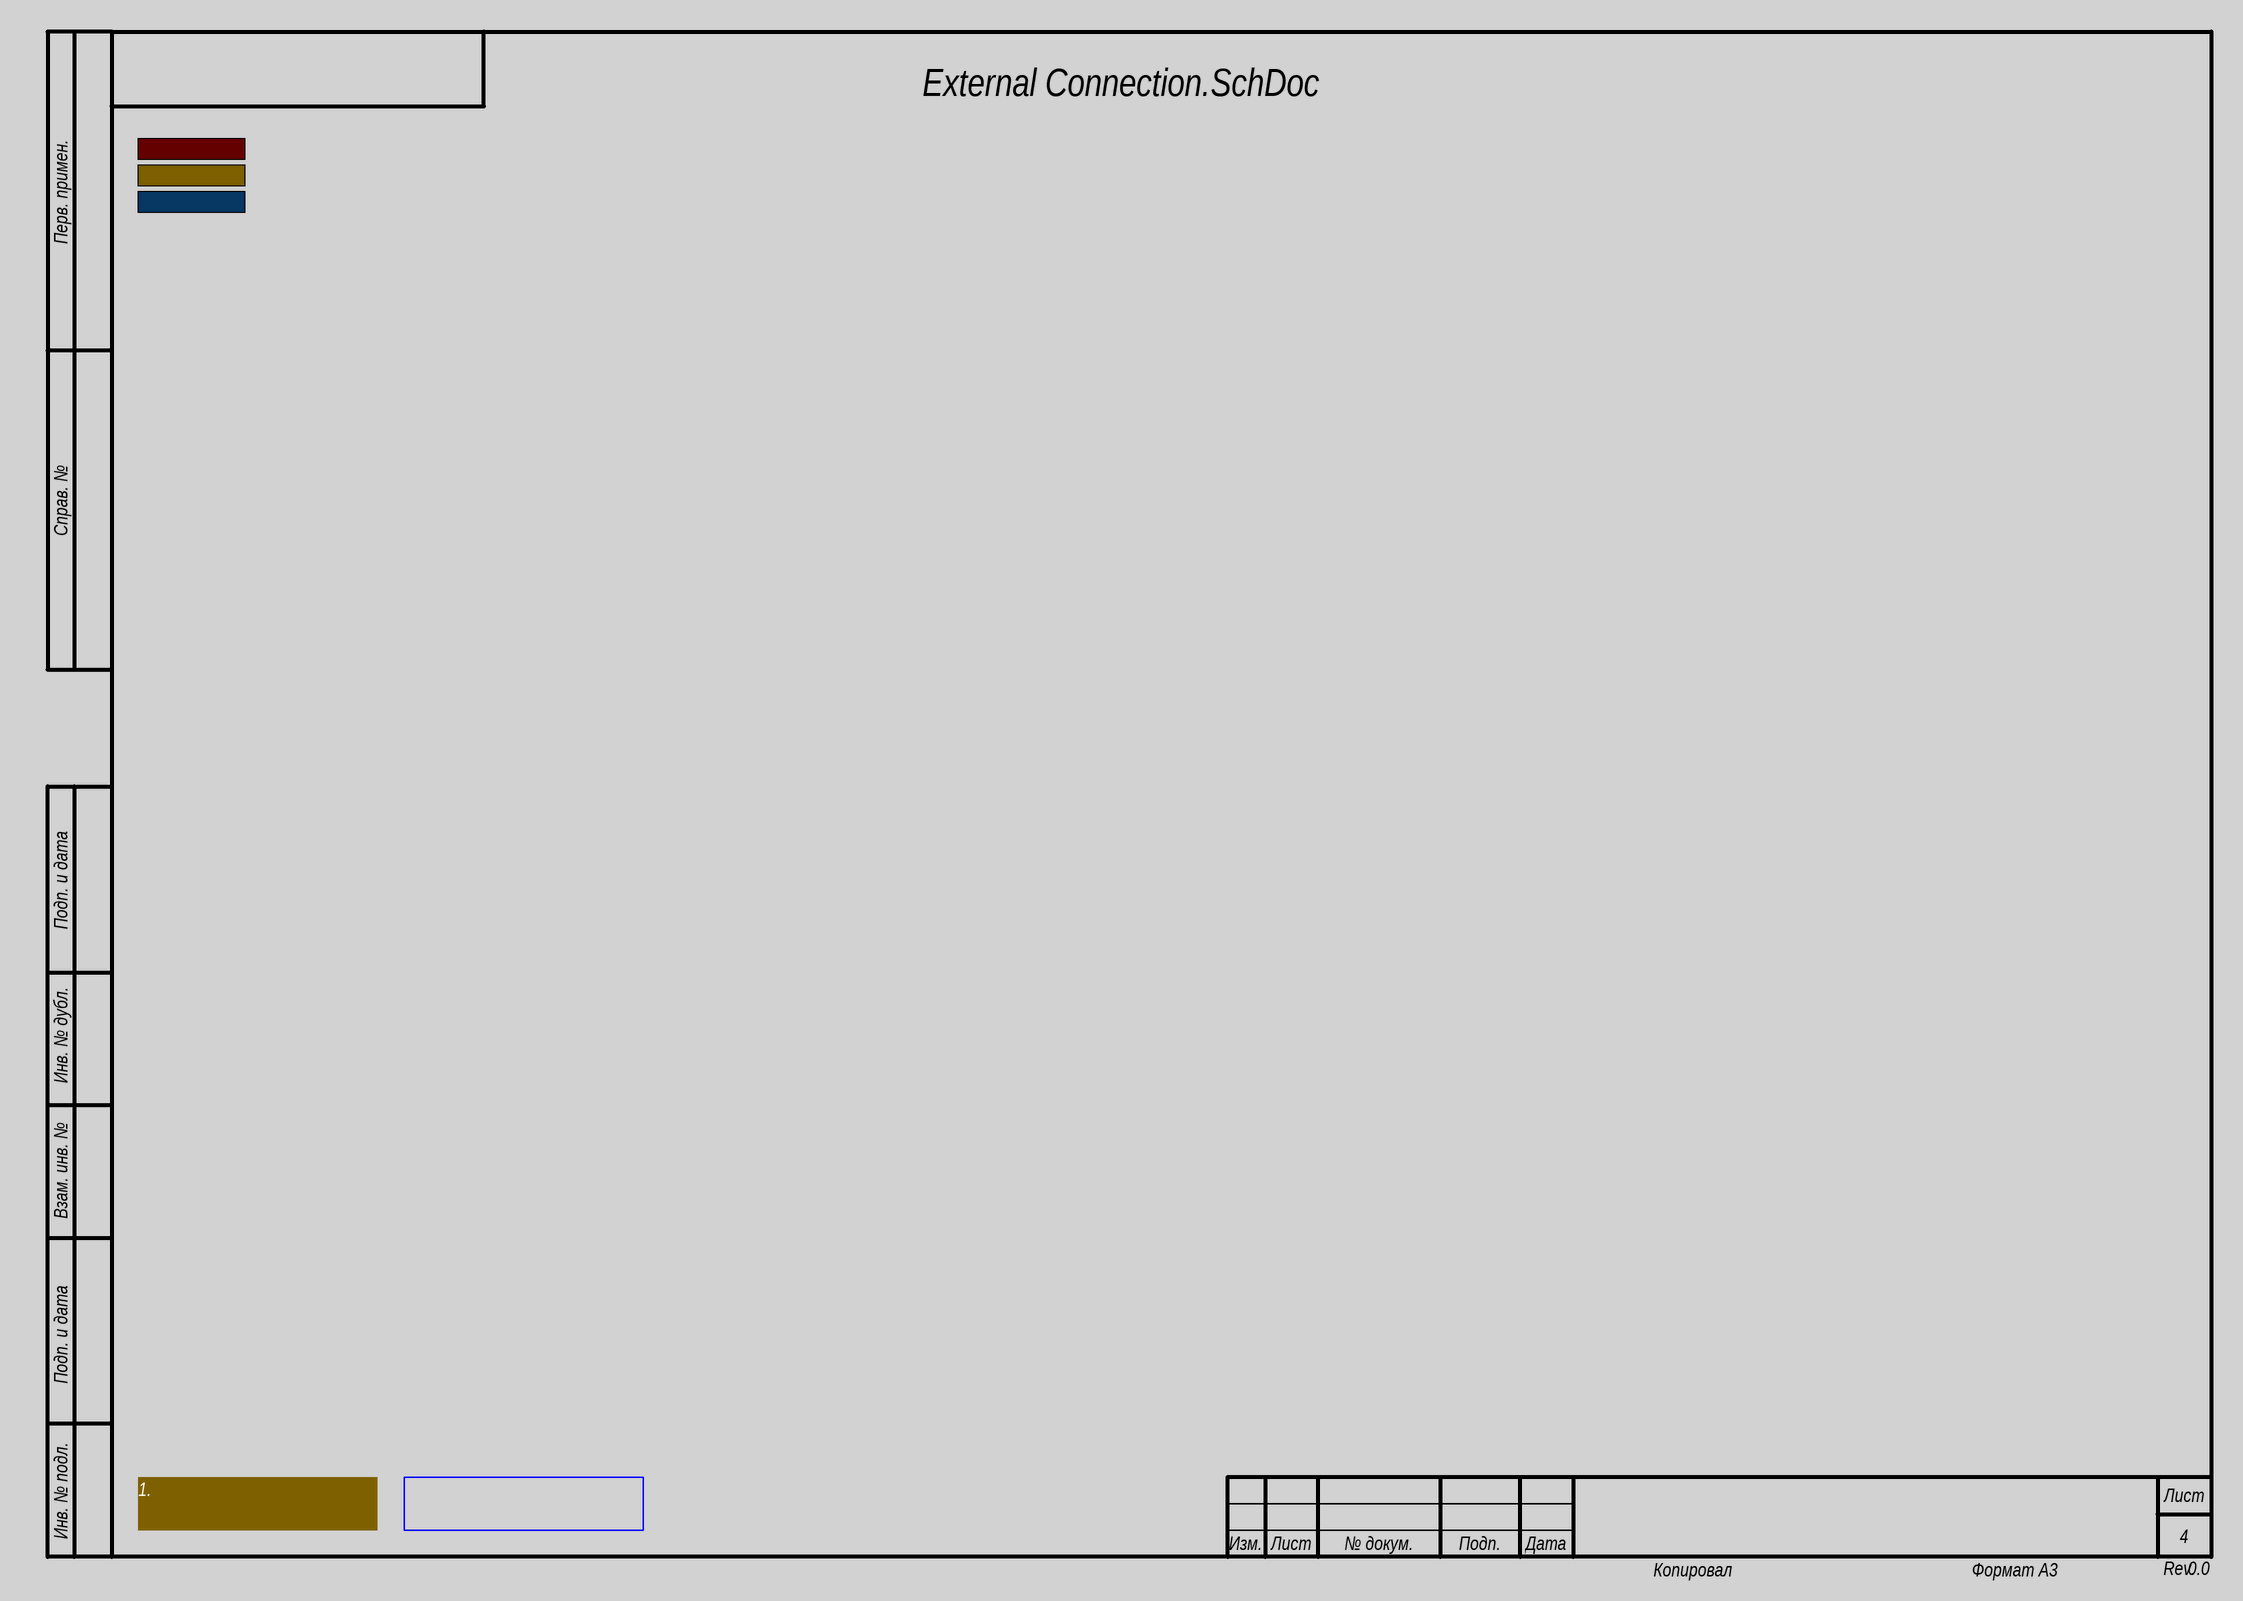
[diagram p8: External Connection.SchDoc]

### Ports
 (in)

### Notes on the sheet
- 1.
- Rev.
- Перв. примен.
- Справ. №
- Подп. и дата
- Инв. № дубл.
- Взам. инв. №
- Инв. № подл.
- Изм.
- Лист
- № докум.
- Подп.
- Дата
- Копировал
- Формат А3

## Sheet Vibration Motor.SchDoc
size 420 x 297 mm; Address1: Address1; Address2: Address2; Address3: Address3; Address4: Address4; DocumentNumber: GMI.430.110; SheetNumber: 10; SheetTotal: 10; DocumentType: Схема электрическая принципиальная
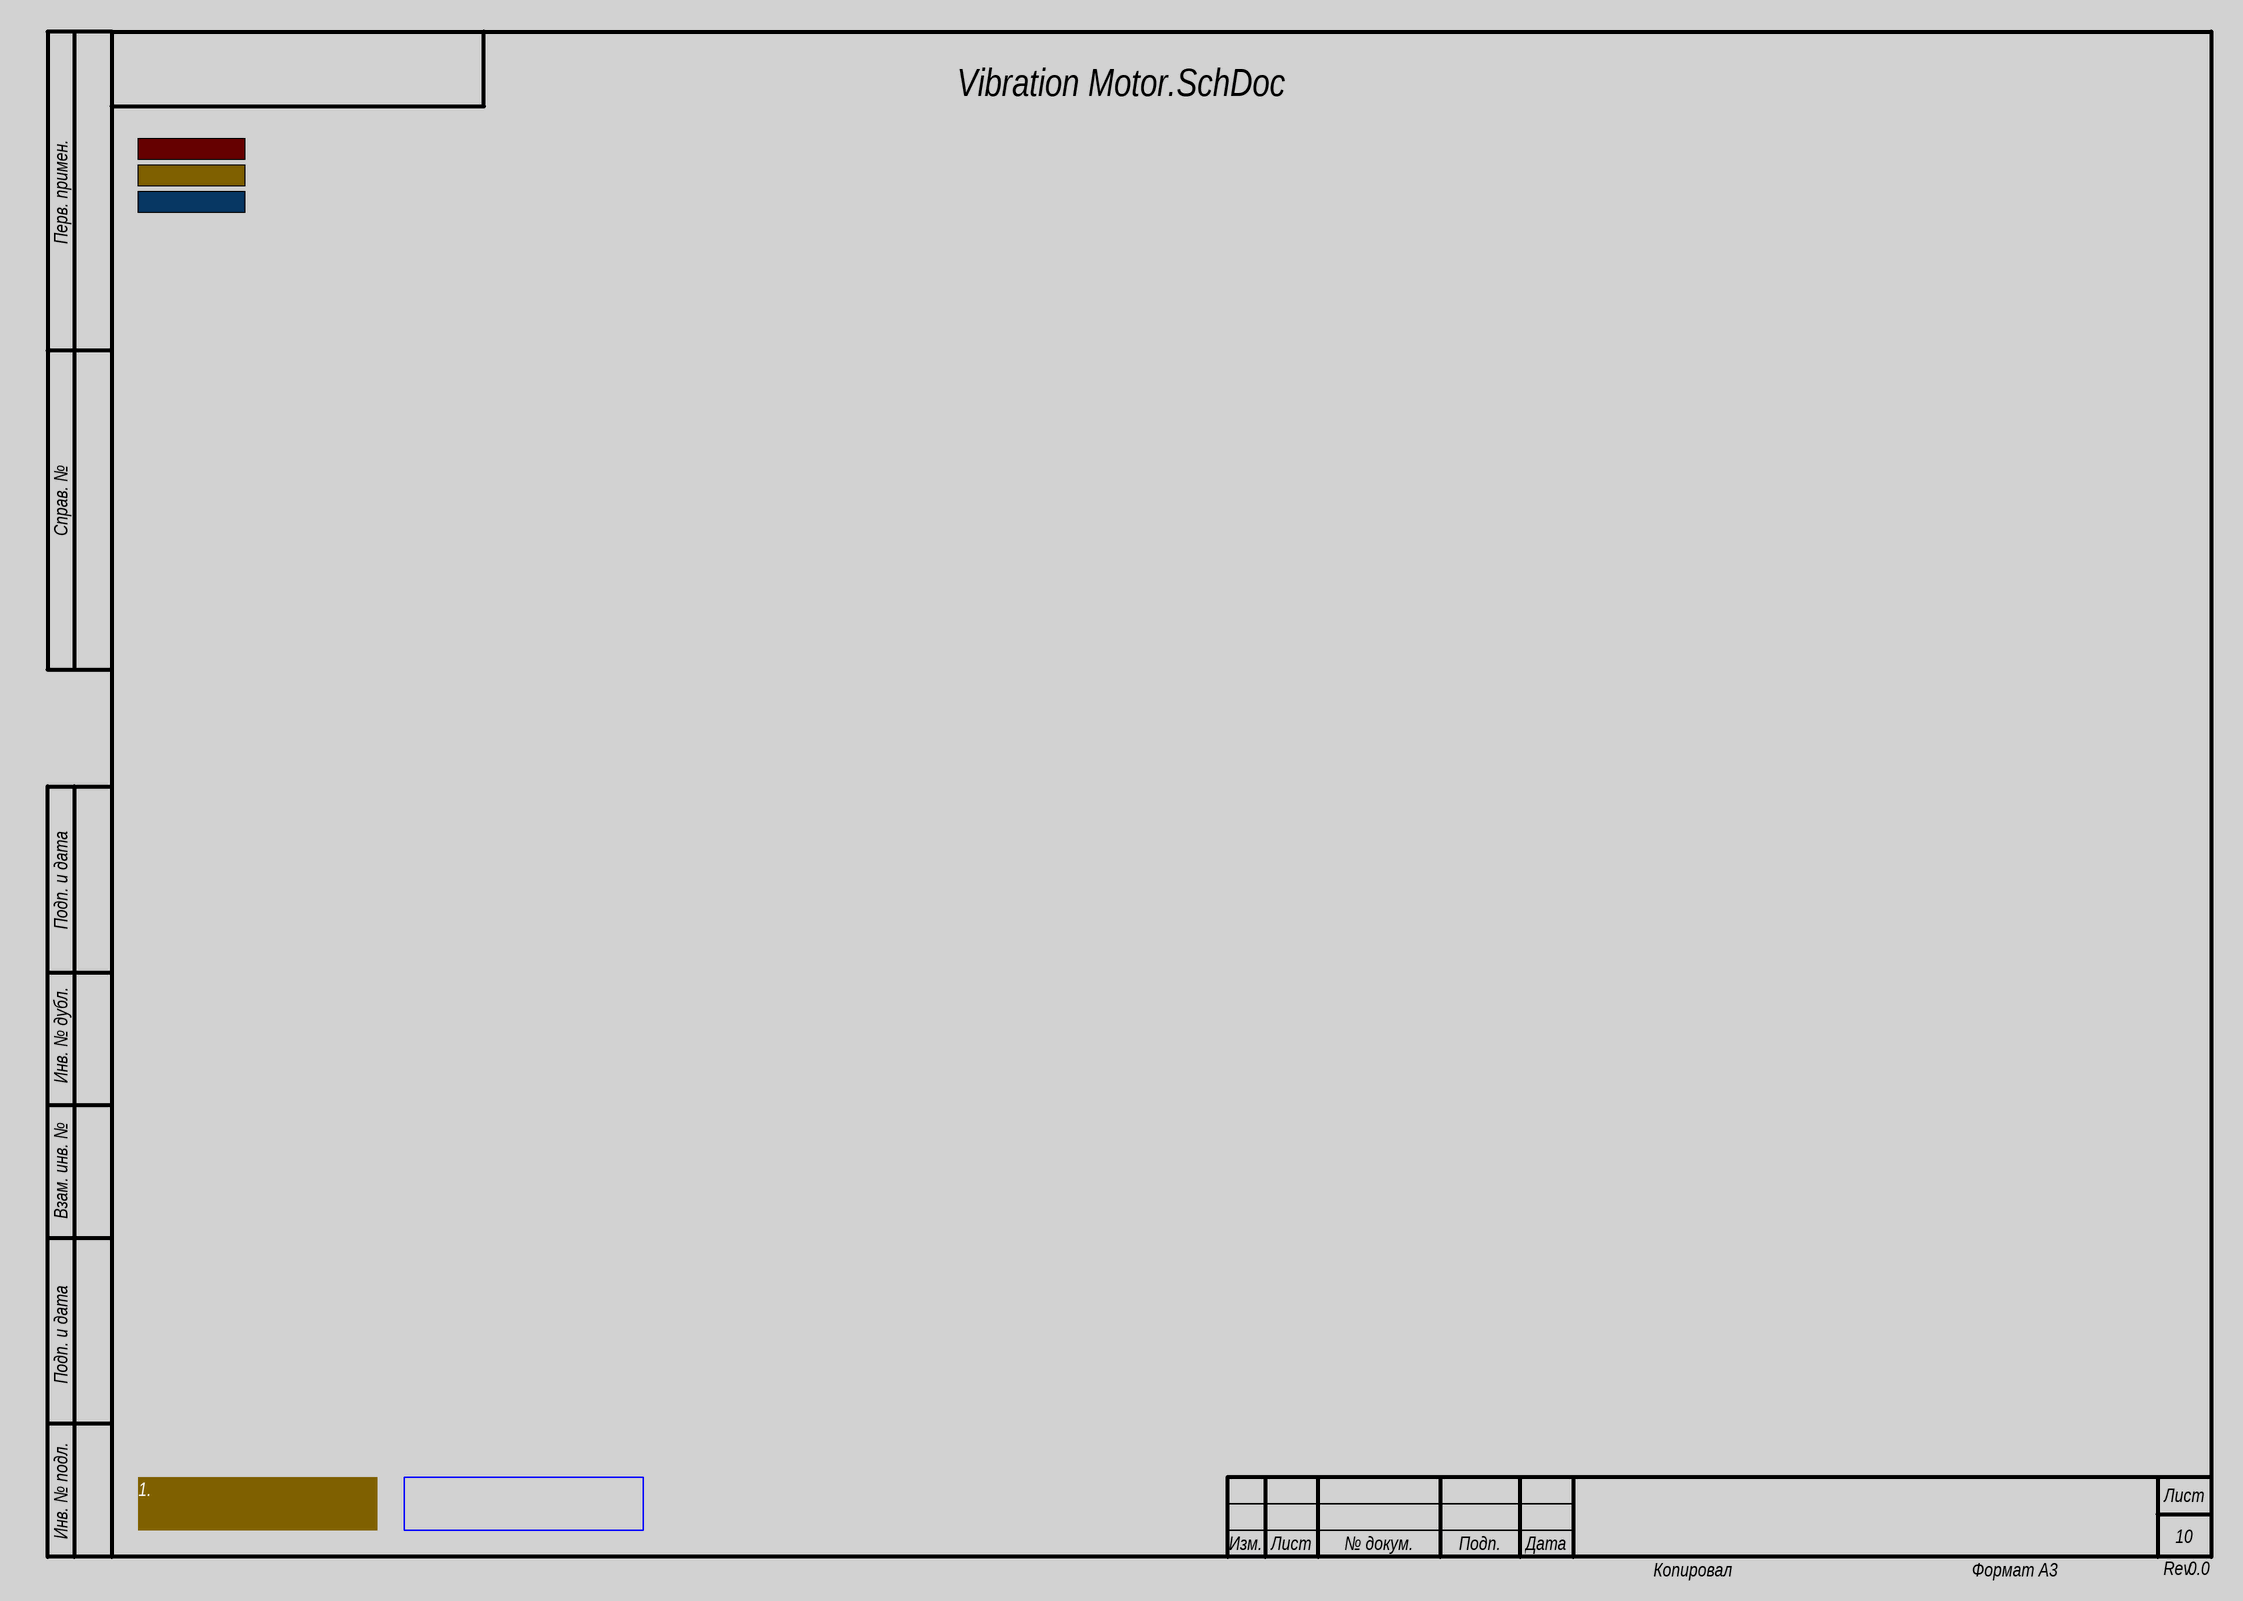
[diagram p9: Vibration Motor.SchDoc]

### Ports
 (in)

### Notes on the sheet
- 1.
- Rev.
- Перв. примен.
- Справ. №
- Подп. и дата
- Инв. № дубл.
- Взам. инв. №
- Инв. № подл.
- Изм.
- Лист
- № докум.
- Подп.
- Дата
- Копировал
- Формат А3